# Altium project TMDX654GPEVM.PrjPcb (part 3 of 24)

## Sheet 15-DDR4 DEVICES.SchDoc
size 513 x 386 mm
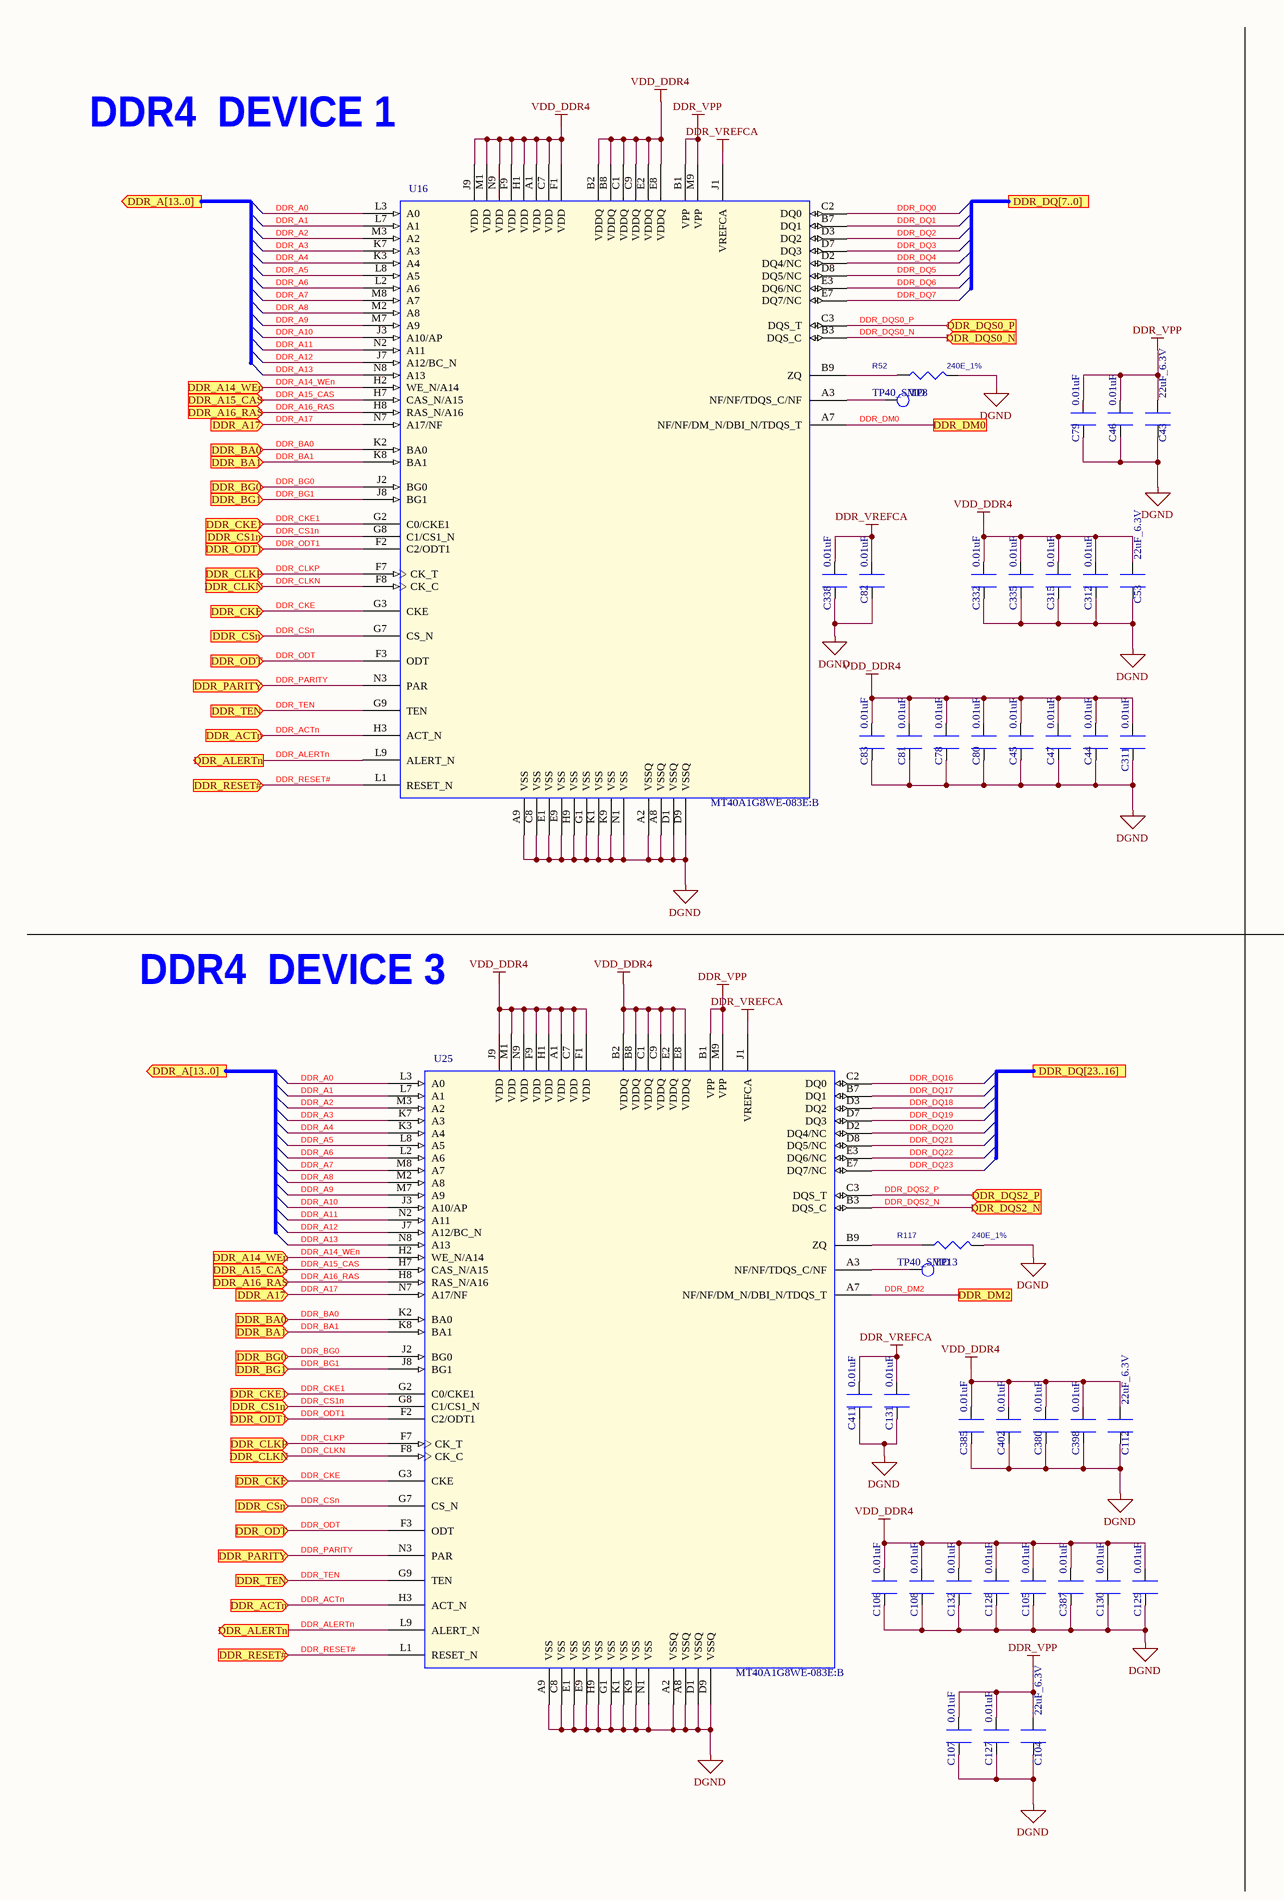
[diagram p20: 15-DDR4 DEVICES.SchDoc, left]
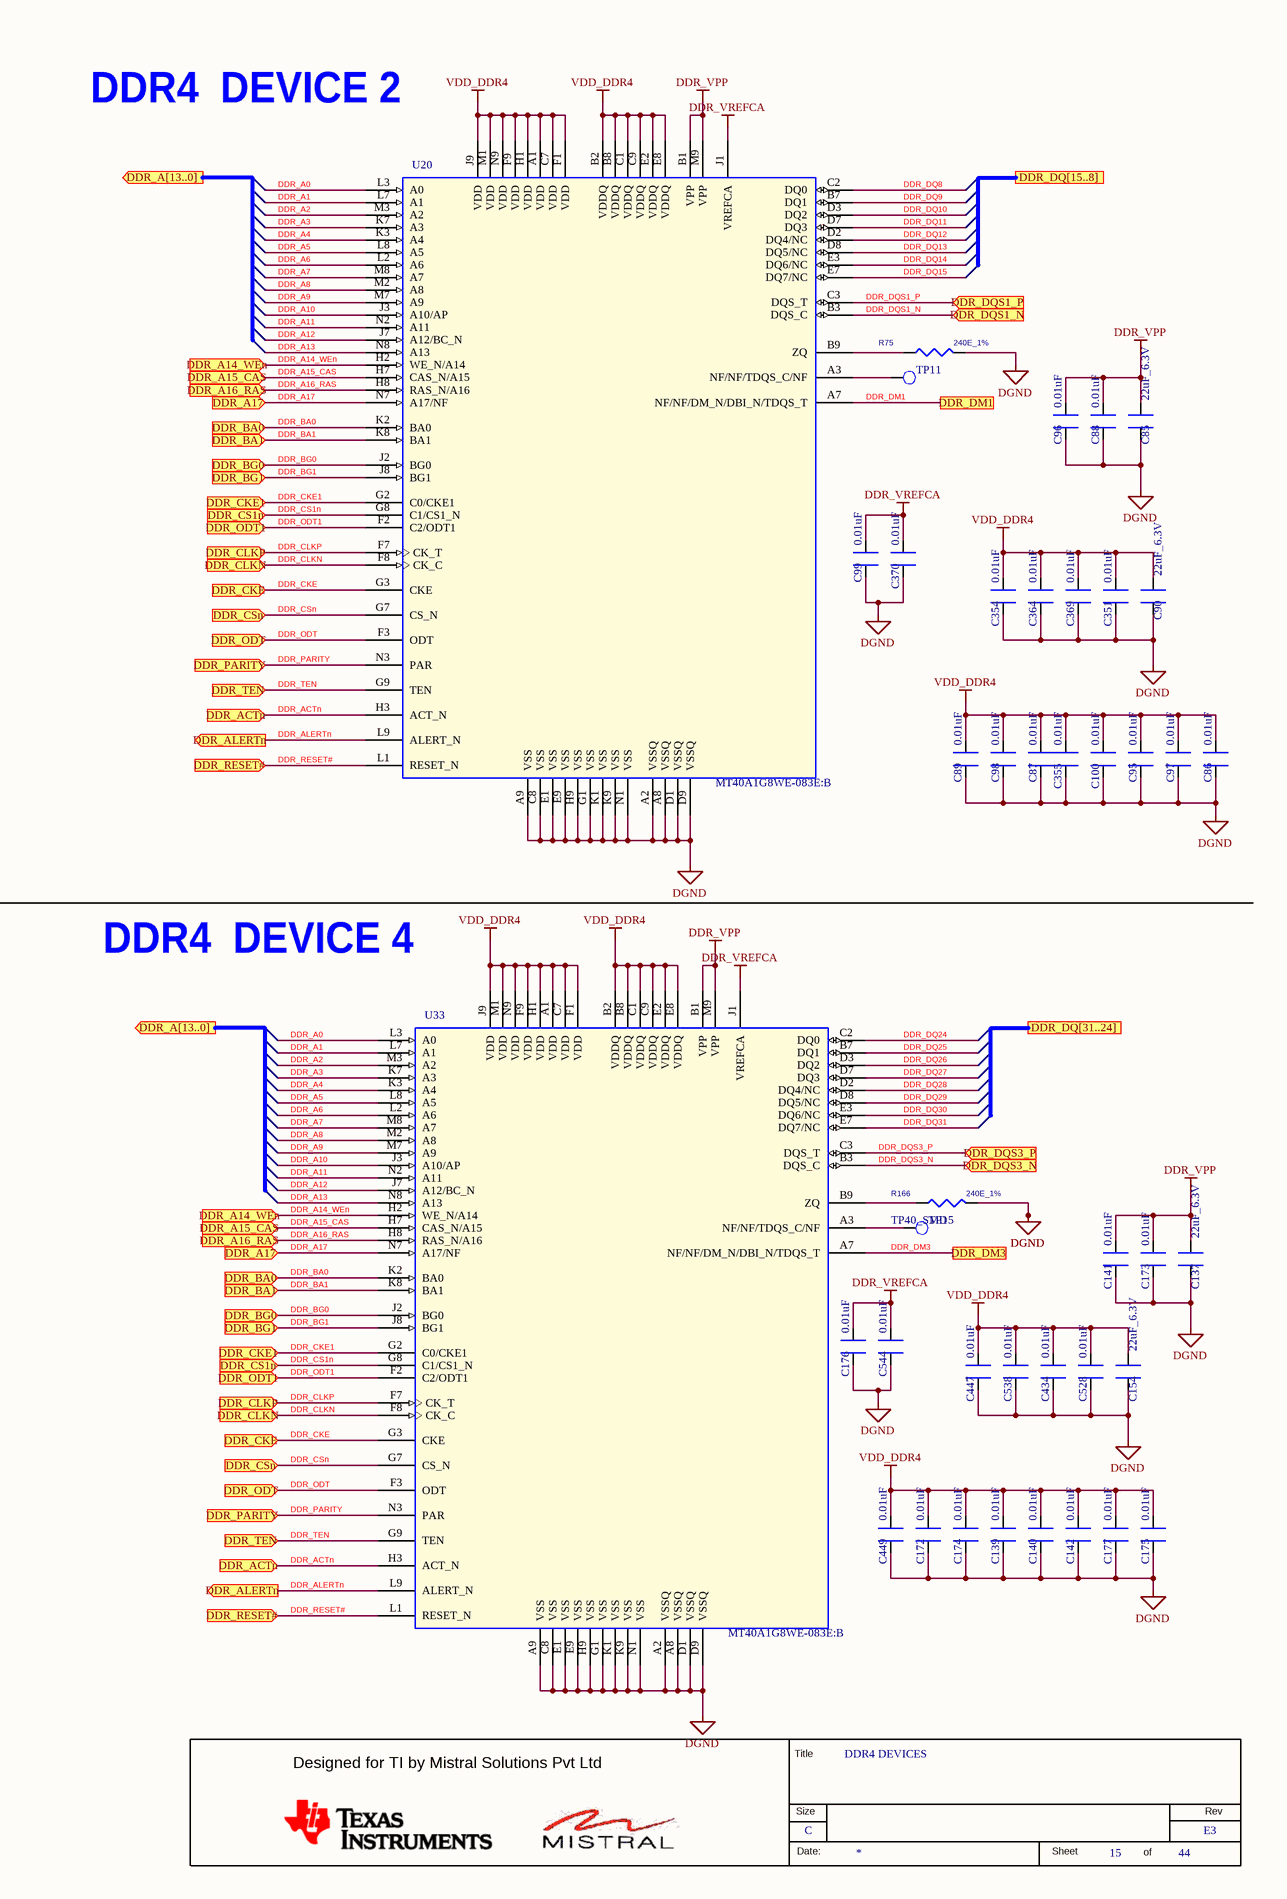
[diagram p21: 15-DDR4 DEVICES.SchDoc, right]

### Parts
(Parts that share a designator on the sheet are numbered #1, #2 ... from top to bottom, then left to right.)
*#15  RevCode: E3  Title: DDR4 DEVICES  Page Size: C  Page Number: 15  Page Count: 44  (hidden comment: MISTRAL_TITLEBLK_CSIZE)  (graphical)
C43  22uF_6.3V  [CAP0603]
C44  0.01uF  [CAP0201_0-5]
C45  0.01uF  [CAP0201_0-5]
C46  0.01uF  [CAP0201_0-5]
C47  0.01uF  [CAP0201_0-5]
C53  22uF_6.3V  [CAP0603]
C78  0.01uF  [CAP0201_0-5]
C79  0.01uF  [CAP0201_0-5]
C80  0.01uF  [CAP0201_0-5]
C81  0.01uF  [CAP0201_0-5]
C82  0.01uF  [CAP0201_0-5]
C83  0.01uF  [CAP0201_0-5]
C85  22uF_6.3V  [CAP0603]
C86  0.01uF  [CAP0201_0-5]
C87  0.01uF  [CAP0201_0-5]
C88  0.01uF  [CAP0201_0-5]
C89  0.01uF  [CAP0201_0-5]
C90  22uF_6.3V  [CAP0603]
C95  0.01uF  [CAP0201_0-5]
C96  0.01uF  [CAP0201_0-5]
C97  0.01uF  [CAP0201_0-5]
C98  0.01uF  [CAP0201_0-5]
C99  0.01uF  [CAP0201_0-5]
C100  0.01uF  [CAP0201_0-5]
C104  22uF_6.3V  [CAP0603]
C105  0.01uF  [CAP0201_0-5]
C106  0.01uF  [CAP0201_0-5]
C107  0.01uF  [CAP0201_0-5]
C108  0.01uF  [CAP0201_0-5]
C112  22uF_6.3V  [CAP0603]
C127  0.01uF  [CAP0201_0-5]
C128  0.01uF  [CAP0201_0-5]
C129  0.01uF  [CAP0201_0-5]
C130  0.01uF  [CAP0201_0-5]
C131  0.01uF  [CAP0201_0-5]
C132  0.01uF  [CAP0201_0-5]
C137  22uF_6.3V  [CAP0603]
C139  0.01uF  [CAP0201_0-5]
C140  0.01uF  [CAP0201_0-5]
C141  0.01uF  [CAP0201_0-5]
C142  0.01uF  [CAP0201_0-5]
C154  22uF_6.3V  [CAP0603]
C172  0.01uF  [CAP0201_0-5]
C173  0.01uF  [CAP0201_0-5]
C174  0.01uF  [CAP0201_0-5]
C175  0.01uF  [CAP0201_0-5]
C176  0.01uF  [CAP0201_0-5]
C177  0.01uF  [CAP0201_0-5]
C311  0.01uF  [CAP0201_0-5]
C312  0.01uF  [CAP0201_0-5]
C315  0.01uF  [CAP0201_0-5]
C332  0.01uF  [CAP0201_0-5]
C335  0.01uF  [CAP0201_0-5]
C338  0.01uF  [CAP0201_0-5]
C351  0.01uF  [CAP0201_0-5]
C354  0.01uF  [CAP0201_0-5]
C355  0.01uF  [CAP0201_0-5]
C364  0.01uF  [CAP0201_0-5]
C369  0.01uF  [CAP0201_0-5]
C370  0.01uF  [CAP0201_0-5]
C380  0.01uF  [CAP0201_0-5]
C385  0.01uF  [CAP0201_0-5]
C387  0.01uF  [CAP0201_0-5]
C398  0.01uF  [CAP0201_0-5]
C402  0.01uF  [CAP0201_0-5]
C411  0.01uF  [CAP0201_0-5]
C434  0.01uF  [CAP0201_0-5]
C447  0.01uF  [CAP0201_0-5]
C449  0.01uF  [CAP0201_0-5]
C528  0.01uF  [CAP0201_0-5]
C538  0.01uF  [CAP0201_0-5]
C544  0.01uF  [CAP0201_0-5]
R52  240E_1%  [RES0402]
R75  240E_1%  [RES0402]
R117  240E_1%  [RES0402]
R166  240E_1%  [RES0402]
TP8  TP40_SMD  [TP40_SMD]
TP11  TP40_SMD  [TP40_SMD]  (value not drawn)
TP13  TP40_SMD  [TP40_SMD]
TP15  TP40_SMD  [TP40_SMD]
U16  MT40A1G8WE-083E:B  [FBGA78_31-49_320X480_1-2]
U20  MT40A1G8WE-083E:B  [FBGA78_31-49_320X480_1-2]
U25  MT40A1G8WE-083E:B  [FBGA78_31-49_320X480_1-2]
U33  MT40A1G8WE-083E:B  [FBGA78_31-49_320X480_1-2]

### Ports
DDR_A14_WEn (in), DDR_A15_CAS (in), DDR_A16_RAS (in), DDR_A17 (in), DDR_A[13..0] (out), DDR_ACTn (in), DDR_ALERTn (out), DDR_BA0 (in), DDR_BA1 (in), DDR_BG0 (in), DDR_BG1 (in), DDR_CKE1 (in), DDR_CKE (in), DDR_CLKN (in), DDR_CLKP (in), DDR_CS1n (in), DDR_CSn (in), DDR_DM0, DDR_DM1, DDR_DM2, DDR_DM3, DDR_DQ[7..0], DDR_DQ[15..8], DDR_DQ[23..16], DDR_DQ[31..24], DDR_DQS0_N (in), DDR_DQS0_P (in), DDR_DQS1_N (in), DDR_DQS1_P (in), DDR_DQS2_N (in), DDR_DQS2_P (in), DDR_DQS3_N (in), DDR_DQS3_P (in), DDR_ODT1 (in), DDR_ODT (in), DDR_PARITY (in), DDR_RESET# (in), DDR_TEN (in)

### Nets
DDR_VPP: C43.1 C46.1 C79.1 C85.1 C88.1 C96.1 C104.1 C107.1 C127.1 C137.1 C141.1 C173.1 U16.B1(VPP) U16.M9(VPP) U20.B1(VPP) U20.M9(VPP) U25.B1(VPP) U25.M9(VPP) U33.B1(VPP) U33.M9(VPP)
DDR_VREFCA: C82.1 C99.1 C131.1 C176.1 C338.1 C370.1 C411.1 C544.1 U16.J1(VREFCA) U20.J1(VREFCA) U25.J1(VREFCA) U33.J1(VREFCA)
DGND: C43.2 C44.2 C45.2 C46.2 C47.2 C53.2 C78.2 C79.2 C80.2 C81.2 C82.2 C83.2 C85.2 C86.2 C87.2 C88.2 C89.2 C90.2 C95.2 C96.2 C97.2 C98.2 C99.2 C100.2 C104.2 C105.2 C106.2 C107.2 C108.2 C112.2 C127.2 C128.2 C129.2 C130.2 C131.2 C132.2 C137.2 C139.2 C140.2 C141.2 C142.2 C154.2 C172.2 C173.2 C174.2 C175.2 C176.2 C177.2 C311.2 C312.2 C315.2 C332.2 C335.2 C338.2 C351.2 C354.2 C355.2 C364.2 C369.2 C370.2 C380.2 C385.2 C387.2 C398.2 C402.2 C411.2 C434.2 C447.2 C449.2 C528.2 C538.2 C544.2 R52.2 R75.2 R117.2 R166.2 U16.A2(VSSQ) U16.A8(VSSQ) U16.A9(VSS) U16.C8(VSS) U16.D1(VSSQ) U16.D9(VSSQ) U16.E1(VSS) U16.E9(VSS) U16.G1(VSS) U16.H9(VSS) U16.K1(VSS) U16.K9(VSS) U16.N1(VSS) U20.A2(VSSQ) U20.A8(VSSQ) U20.A9(VSS) U20.C8(VSS) U20.D1(VSSQ) U20.D9(VSSQ) U20.E1(VSS) U20.E9(VSS) U20.G1(VSS) U20.H9(VSS) U20.K1(VSS) U20.K9(VSS) U20.N1(VSS) U25.A2(VSSQ) U25.A8(VSSQ) U25.A9(VSS) U25.C8(VSS) U25.D1(VSSQ) U25.D9(VSSQ) U25.E1(VSS) U25.E9(VSS) U25.G1(VSS) U25.H9(VSS) U25.K1(VSS) U25.K9(VSS) U25.N1(VSS) U33.A2(VSSQ) U33.A8(VSSQ) U33.A9(VSS) U33.C8(VSS) U33.D1(VSSQ) U33.D9(VSSQ) U33.E1(VSS) U33.E9(VSS) U33.G1(VSS) U33.H9(VSS) U33.K1(VSS) U33.K9(VSS) U33.N1(VSS)
VDD_DDR4: C44.1 C45.1 C47.1 C53.1 C78.1 C80.1 C81.1 C83.1 C86.1 C87.1 C89.1 C90.1 C95.1 C97.1 C98.1 C100.1 C105.1 C106.1 C108.1 C112.1 C128.1 C129.1 C130.1 C132.1 C139.1 C140.1 C142.1 C154.1 C172.1 C174.1 C175.1 C177.1 C311.1 C312.1 C315.1 C332.1 C335.1 C351.1 C354.1 C355.1 C364.1 C369.1 C380.1 C385.1 C387.1 C398.1 C402.1 C434.1 C447.1 C449.1 C528.1 C538.1 U16.A1(VDD) U16.B2(VDDQ) U16.B8(VDDQ) U16.C1(VDDQ) U16.C7(VDD) U16.C9(VDDQ) U16.E2(VDDQ) U16.E8(VDDQ) U16.F1(VDD) U16.F9(VDD) U16.H1(VDD) U16.J9(VDD) U16.M1(VDD) U16.N9(VDD) U20.A1(VDD) U20.B2(VDDQ) U20.B8(VDDQ) U20.C1(VDDQ) U20.C7(VDD) U20.C9(VDDQ) U20.E2(VDDQ) U20.E8(VDDQ) U20.F1(VDD) U20.F9(VDD) U20.H1(VDD) U20.J9(VDD) U20.M1(VDD) U20.N9(VDD) U25.A1(VDD) U25.B2(VDDQ) U25.B8(VDDQ) U25.C1(VDDQ) U25.C7(VDD) U25.C9(VDDQ) U25.E2(VDDQ) U25.E8(VDDQ) U25.F1(VDD) U25.F9(VDD) U25.H1(VDD) U25.J9(VDD) U25.M1(VDD) U25.N9(VDD) U33.A1(VDD) U33.B2(VDDQ) U33.B8(VDDQ) U33.C1(VDDQ) U33.C7(VDD) U33.C9(VDDQ) U33.E2(VDDQ) U33.E8(VDDQ) U33.F1(VDD) U33.F9(VDD) U33.H1(VDD) U33.J9(VDD) U33.M1(VDD) U33.N9(VDD)
DDR_A0: U16.L3(A0) U20.L3(A0) U25.L3(A0) U33.L3(A0)
DDR_A1: U16.L7(A1) U20.L7(A1) U25.L7(A1) U33.L7(A1)
DDR_A2: U16.M3(A2) U20.M3(A2) U25.M3(A2) U33.M3(A2)
DDR_A3: U16.K7(A3) U20.K7(A3) U25.K7(A3) U33.K7(A3)
DDR_A4: U16.K3(A4) U20.K3(A4) U25.K3(A4) U33.K3(A4)
DDR_A5: U16.L8(A5) U20.L8(A5) U25.L8(A5) U33.L8(A5)
DDR_A6: U16.L2(A6) U20.L2(A6) U25.L2(A6) U33.L2(A6)
DDR_A7: U16.M8(A7) U20.M8(A7) U25.M8(A7) U33.M8(A7)
DDR_A8: U16.M2(A8) U20.M2(A8) U25.M2(A8) U33.M2(A8)
DDR_A9: U16.M7(A9) U20.M7(A9) U25.M7(A9) U33.M7(A9)
DDR_A10: U16.J3(A10/AP) U20.J3(A10/AP) U25.J3(A10/AP) U33.J3(A10/AP)
DDR_A11: U16.N2(A11) U20.N2(A11) U25.N2(A11) U33.N2(A11)
DDR_A12: U16.J7(A12/BC_N) U20.J7(A12/BC_N) U25.J7(A12/BC_N) U33.J7(A12/BC_N)
DDR_A13: U16.N8(A13) U20.N8(A13) U25.N8(A13) U33.N8(A13)
DDR_A14_WEn: U16.H2(WE_N/A14) U20.H2(WE_N/A14) U25.H2(WE_N/A14) U33.H2(WE_N/A14) ; port DDR_A14_WEn
DDR_A15_CAS: U16.H7(CAS_N/A15) U20.H7(CAS_N/A15) U25.H7(CAS_N/A15) U33.H7(CAS_N/A15) ; port DDR_A15_CAS
DDR_A16_RAS: U16.H8(RAS_N/A16) U20.H8(RAS_N/A16) U25.H8(RAS_N/A16) U33.H8(RAS_N/A16) ; port DDR_A16_RAS
DDR_A17: U16.N7(A17/NF) U20.N7(A17/NF) U25.N7(A17/NF) U33.N7(A17/NF) ; port DDR_A17
DDR_ACTn: U16.H3(ACT_N) U20.H3(ACT_N) U25.H3(ACT_N) U33.H3(ACT_N) ; port DDR_ACTn
DDR_ALERTn: U16.L9(ALERT_N) U20.L9(ALERT_N) U25.L9(ALERT_N) U33.L9(ALERT_N) ; port DDR_ALERTn
DDR_BA0: U16.K2(BA0) U20.K2(BA0) U25.K2(BA0) U33.K2(BA0) ; port DDR_BA0
DDR_BA1: U16.K8(BA1) U20.K8(BA1) U25.K8(BA1) U33.K8(BA1) ; port DDR_BA1
DDR_BG0: U16.J2(BG0) U20.J2(BG0) U25.J2(BG0) U33.J2(BG0) ; port DDR_BG0
DDR_BG1: U16.J8(BG1) U20.J8(BG1) U25.J8(BG1) U33.J8(BG1) ; port DDR_BG1
DDR_CKE: U16.G3(CKE) U20.G3(CKE) U25.G3(CKE) U33.G3(CKE) ; port DDR_CKE
DDR_CKE1: U16.G2(C0/CKE1) U20.G2(C0/CKE1) U25.G2(C0/CKE1) U33.G2(C0/CKE1) ; port DDR_CKE1
DDR_CLKN: U16.F8(CK_C) U20.F8(CK_C) U25.F8(CK_C) U33.F8(CK_C) ; port DDR_CLKN
DDR_CLKP: U16.F7(CK_T) U20.F7(CK_T) U25.F7(CK_T) U33.F7(CK_T) ; port DDR_CLKP
DDR_CS1n: U16.G8(C1/CS1_N) U20.G8(C1/CS1_N) U25.G8(C1/CS1_N) U33.G8(C1/CS1_N) ; port DDR_CS1n
DDR_CSn: U16.G7(CS_N) U20.G7(CS_N) U25.G7(CS_N) U33.G7(CS_N) ; port DDR_CSn
DDR_DM0: U16.A7(NF/NF/DM_N/DBI_N/TDQS_T) ; port DDR_DM0
DDR_DM1: U20.A7(NF/NF/DM_N/DBI_N/TDQS_T) ; port DDR_DM1
DDR_DM2: U25.A7(NF/NF/DM_N/DBI_N/TDQS_T) ; port DDR_DM2
DDR_DM3: U33.A7(NF/NF/DM_N/DBI_N/TDQS_T) ; port DDR_DM3
DDR_DQ0: U16.C2(DQ0)
DDR_DQ1: U16.B7(DQ1)
DDR_DQ2: U16.D3(DQ2)
DDR_DQ3: U16.D7(DQ3)
DDR_DQ4: U16.D2(DQ4/NC)
DDR_DQ5: U16.D8(DQ5/NC)
DDR_DQ6: U16.E3(DQ6/NC)
DDR_DQ7: U16.E7(DQ7/NC)
DDR_DQ8: U20.C2(DQ0)
DDR_DQ9: U20.B7(DQ1)
DDR_DQ10: U20.D3(DQ2)
DDR_DQ11: U20.D7(DQ3)
DDR_DQ12: U20.D2(DQ4/NC)
DDR_DQ13: U20.D8(DQ5/NC)
DDR_DQ14: U20.E3(DQ6/NC)
DDR_DQ15: U20.E7(DQ7/NC)
DDR_DQ16: U25.C2(DQ0)
DDR_DQ17: U25.B7(DQ1)
DDR_DQ18: U25.D3(DQ2)
DDR_DQ19: U25.D7(DQ3)
DDR_DQ20: U25.D2(DQ4/NC)
DDR_DQ21: U25.D8(DQ5/NC)
DDR_DQ22: U25.E3(DQ6/NC)
DDR_DQ23: U25.E7(DQ7/NC)
DDR_DQ24: U33.C2(DQ0)
DDR_DQ25: U33.B7(DQ1)
DDR_DQ26: U33.D3(DQ2)
DDR_DQ27: U33.D7(DQ3)
DDR_DQ28: U33.D2(DQ4/NC)
DDR_DQ29: U33.D8(DQ5/NC)
DDR_DQ30: U33.E3(DQ6/NC)
DDR_DQ31: U33.E7(DQ7/NC)
DDR_DQS0_N: U16.B3(DQS_C) ; port DDR_DQS0_N
DDR_DQS0_P: U16.C3(DQS_T) ; port DDR_DQS0_P
DDR_DQS1_N: U20.B3(DQS_C) ; port DDR_DQS1_N
DDR_DQS1_P: U20.C3(DQS_T) ; port DDR_DQS1_P
DDR_DQS2_N: U25.B3(DQS_C) ; port DDR_DQS2_N
DDR_DQS2_P: U25.C3(DQS_T) ; port DDR_DQS2_P
DDR_DQS3_N: U33.B3(DQS_C) ; port DDR_DQS3_N
DDR_DQS3_P: U33.C3(DQS_T) ; port DDR_DQS3_P
DDR_ODT: U16.F3(ODT) U20.F3(ODT) U25.F3(ODT) U33.F3(ODT) ; port DDR_ODT
DDR_ODT1: U16.F2(C2/ODT1) U20.F2(C2/ODT1) U25.F2(C2/ODT1) U33.F2(C2/ODT1) ; port DDR_ODT1
DDR_PARITY: U16.N3(PAR) U20.N3(PAR) U25.N3(PAR) U33.N3(PAR) ; port DDR_PARITY
DDR_RESET#: U16.L1(RESET_N) U20.L1(RESET_N) U25.L1(RESET_N) U33.L1(RESET_N) ; port DDR_RESET#
DDR_TEN: U16.G9(TEN) U20.G9(TEN) U25.G9(TEN) U33.G9(TEN) ; port DDR_TEN
NetR52_1: R52.1 U16.B9(ZQ)
NetR75_1: R75.1 U20.B9(ZQ)
NetR117_1: R117.1 U25.B9(ZQ)
NetR166_1: R166.1 U33.B9(ZQ)
NetTP8_1: TP8.1(TP) U16.A3(NF/NF/TDQS_C/NF)
NetTP11_1: TP11.1(TP) U20.A3(NF/NF/TDQS_C/NF)
NetTP13_1: TP13.1(TP) U25.A3(NF/NF/TDQS_C/NF)
NetTP15_1: TP15.1(TP) U33.A3(NF/NF/TDQS_C/NF)

### Notes on the sheet
- DDR4  DEVICE 1
- DDR4  DEVICE 2
- DDR4  DEVICE 3
- DDR4  DEVICE 4
- (in symbol MISTRAL_TITLEBLK_CSIZE) Title; Designed for TI by Mistral Solutions Pvt Ltd; Size; Rev; Date:; Sheet; of

### Library data of the parts
*#15 = MISTRAL_TITLEBLK_CSIZE: Issue: 1.0; Page Create Date: March  8, 1995; Page Modify Date: *
C43 C90 C112 C154 = CAP_Dup3: CAP CERAMIC 22uF 6.3V 20% X5R 0603; Alternate_mfr_part_number_A: CC0603MRX5R5BB226; Alternate_mfr_name_A: YAGEO AMERICA; Part_type: CAPACITORS\CERAMIC; Mfr_part_number: GRM188R60J226MEA0; Mfr_name: MURATA; Mistral Part No: 120015090007-R; Custom_Duty: 15%; Customs_HS_Code: 85322990; Wattage: NA; Project: OCTBTS_3000; Distributor_part_number_A: 311-1815-1-ND; Distributor_name_A: DIGIKEY; Library Ref: CAP; Chkd/date: JEBRAN/090915; Crtd /date: JEBRAN/090915; Datasheet: Y:\MIS_DATABASE\DATASHEETS\CAPACITORS\GRM188SERIES.PDF; Temperature: -55°C+85°C; Weight: NA; Height: 1.00MM; Distributor_part_number: 490-7611-2-ND; Distributor_name: DIGIKEY; Package: 0603; Voltage: 6.3V; Tolerance: 20%; PCB Footprint: CAP0603
C44-C47 C78-C81 C83 C87 C89 C95 C97 C98 C100 C105 C106 C108 C128 C130 C132 C139 C140 C142 C172 C174 C177 C311 C351 C354 C355 C364 C369 C380 C385 C387 C398 C402 C434 C447 C449 C528 C538 = CAP_Dup3: CAP CERAMIC 0.01uF 25V 10% X5R 0201; Mistral Part No: 120018010007-R; Mfr_name: MURATA; Mfr_part_number: GRM033R61E103KA12J; Part_type: CAPACITORS\CERAMIC; Wattage: NA; Project: TI_MAXIE_CPB; Customs_HS_Code: 85322990; Custom_Duty: 15%; Library Ref: CAP; MECHANICAL 3D STEP FILE: CAP0201_0-5; Temperature: -55°C+85°C; Weight: 0.33mg; PCB Footprint: CAP0201_0-5; Tolerance: 10%; Voltage: 25V; Package: 0201; Distributor_name: DIGIKEY; Distributor_part_number: GRM033R61E103KA12J-ND; Height: 0.33MM; Datasheet: Y:\MIS_DATABASE\DATASHEETS\CAPACITORS\GRM033R61E103KA12.PDF; Crtd /date: MANIRAJA/230118; Chkd/date: MANIRAJA/230118
C53 C104 C137 = CAP_Dup3: CAP CERAMIC 22uF 6.3V 20% X5R 0603; Alternate_mfr_part_number_A: CC0603MRX5R5BB226; Alternate_mfr_name_A: YAGEO AMERICA; Mistral Part No: 120015090007-R; Mfr_name: MURATA; Mfr_part_number: GRM188R60J226MEA0; Part_type: CAPACITORS\CERAMIC; Project: OCTBTS_3000; Wattage: NA; Customs_HS_Code: 85322990; Custom_Duty: 15%; Distributor_part_number_A: 311-1815-1-ND; Distributor_name_A: DIGIKEY; Library Ref: CAP; Tolerance: 20%; Voltage: 6.3V; Package: 0603; Distributor_name: DIGIKEY; Distributor_part_number: 490-7611-2-ND; Height: 1.00MM; Weight: NA; Temperature: -55°C+85°C; Datasheet: Y:\MIS_DATABASE\DATASHEETS\CAPACITORS\GRM188SERIES.PDF; Crtd /date: JEBRAN/090915; Chkd/date: JEBRAN/090915; PCB Footprint: CAP0603
C82 C86 C88 C96 C99 C107 C127 C129 C131 C141 C173 C175 C176 C312 C315 C332 C335 C338 C370 C411 C544 = CAP_Dup3: CAP CERAMIC 0.01uF 25V 10% X5R 0201; Part_type: CAPACITORS\CERAMIC; Mfr_part_number: GRM033R61E103KA12J; Mfr_name: MURATA; Mistral Part No: 120018010007-R; Wattage: NA; Custom_Duty: 15%; Customs_HS_Code: 85322990; Project: TI_MAXIE_CPB; Library Ref: CAP; MECHANICAL 3D STEP FILE: CAP0201_0-5; Temperature: -55°C+85°C; Weight: 0.33mg; PCB Footprint: CAP0201_0-5; Chkd/date: MANIRAJA/230118; Crtd /date: MANIRAJA/230118; Datasheet: Y:\MIS_DATABASE\DATASHEETS\CAPACITORS\GRM033R61E103KA12.PDF; Height: 0.33MM; Distributor_part_number: GRM033R61E103KA12J-ND; Distributor_name: DIGIKEY; Package: 0201; Voltage: 25V; Tolerance: 10%
C85 = CAP_Dup3: CAP CERAMIC 22uF 6.3V 20% X5R 0603; Part_type: CAPACITORS\CERAMIC; Mfr_part_number: GRM188R60J226MEA0; Mfr_name: MURATA; Mistral Part No: 120015090007-R; Alternate_mfr_name_A: YAGEO AMERICA; Alternate_mfr_part_number_A: CC0603MRX5R5BB226; Custom_Duty: 15%; Customs_HS_Code: 85322990; Wattage: NA; Project: OCTBTS_3000; Chkd/date: JEBRAN/090915; Crtd /date: JEBRAN/090915; Datasheet: Y:\MIS_DATABASE\DATASHEETS\CAPACITORS\GRM188SERIES.PDF; Temperature: -55°C+85°C; Weight: NA; Height: 1.00MM; Distributor_part_number: 490-7611-2-ND; Distributor_name: DIGIKEY; Package: 0603; Voltage: 6.3V; Tolerance: 20%; Library Ref: CAP; Distributor_name_A: DIGIKEY; Distributor_part_number_A: 311-1815-1-ND; PCB Footprint: CAP0603
R52 R75 = RESISTOR_Dup1: RES 240E 1/10W 1% 0402; Part_type: RESISTORS\FIXED; Mfr_part_number: ERJ-2RKF2400X; Mfr_name: PANASONIC-ECG; Mistral Part No: 110011060017-R; Custom_Duty: 15%; Customs_HS_Code: 85332119; Voltage: NA; Project: AM4515_EVM_LCD; Library Ref: RESISTOR; Chkd/date: MAZHAR/150611; Crtd /date: BAVISH/020611; Datasheet: Y:\MIS_DATABASE\DATASHEETS\RESISTORS\ERJ-2R.PDF; Temperature: -55°C+125°C; Weight: 0.8/1000g; Height: 0.40MM; Distributor_part_number: P240LCT-ND; Distributor_name: DIGIKEY; Package: 0402; Wattage: 1/10W; Tolerance: 1%; PCB Footprint: RES0402
R117 R166 = RESISTOR_Dup1: RES 240E 1/10W 1% 0402; Mistral Part No: 110011060017-R; Mfr_name: PANASONIC-ECG; Mfr_part_number: ERJ-2RKF2400X; Part_type: RESISTORS\FIXED; Project: AM4515_EVM_LCD; Voltage: NA; Customs_HS_Code: 85332119; Custom_Duty: 15%; Library Ref: RESISTOR; Tolerance: 1%; Wattage: 1/10W; Package: 0402; Distributor_name: DIGIKEY; Distributor_part_number: P240LCT-ND; Height: 0.40MM; Weight: 0.8/1000g; Temperature: -55°C+125°C; Datasheet: Y:\MIS_DATABASE\DATASHEETS\RESISTORS\ERJ-2R.PDF; Crtd /date: BAVISH/020611; Chkd/date: MAZHAR/150611; PCB Footprint: RES0402
TP8 TP13 TP15 = TESTPOINT: TESTPOINT CIR 40 SMD; Mistral Part No: 130009030933; Mfr_name: LOCAL; MECHANICAL 3D STEP FILE: NA; Project: RAINIER-3; NI_MARK: DNI; RoHS: NA; Footprint Ref: TP40_SMD; Library Ref: TESTPOINT; Footprint Path: Y:\MIS_DATABASE\Library\ALTIUM_TOOL\PCB_FOOTPRINTS\Altium_Footprint_Lib.PcbLib; Library Path: Y:\MIS_DATABASE\Library\ALTIUM_TOOL\SCHEMATICS_PARTS\MS_DISCRETE_Library.schlib; Datasheet: NA; Temperature: NA; Weight: NA; Wattage: NA; Voltage: NA; Tolerance: NA; Mfr_part_number: TP40_SMD; Part_type: TESTPOINT; Package: SMD; Distributor_name: NA; Distributor_part_number: NA; Height: NA; Crtd /date: MAZHAR/190505; Chkd/date: MAZHAR/190505; PCB Footprint: TP40_SMD
TP11 = TESTPOINT: TESTPOINT CIR 40 SMD; Mfr_name: LOCAL; Mistral Part No: 130009030933; Project: RAINIER-3; Tolerance: NA; NI_MARK: DNI; Chkd/date: MAZHAR/190505; Crtd /date: MAZHAR/190505; Height: NA; Distributor_part_number: NA; Distributor_name: NA; Package: SMD; Part_type: TESTPOINT; Mfr_part_number: TP40_SMD; Voltage: NA; Wattage: NA; Weight: NA; Temperature: NA; Datasheet: NA; MECHANICAL 3D STEP FILE: NA; Library Path: Y:\MIS_DATABASE\Library\ALTIUM_TOOL\SCHEMATICS_PARTS\MS_DISCRETE_Library.schlib; Footprint Path: Y:\MIS_DATABASE\Library\ALTIUM_TOOL\PCB_FOOTPRINTS\Altium_Footprint_Lib.PcbLib; Library Ref: TESTPOINT; Footprint Ref: TP40_SMD; RoHS: NA; PCB Footprint: TP40_SMD
U16 U20 = MT40A1G8WE-083_FBGA78: IC 1G8 DDR4 SDRAM MEMORY FBGA78; Part_type: ICS\DIGITAL\MEMORY; Mfr_name: MICRON; Mistral Part No: 141117080006-R; Custom_Duty: 15%; Customs_HS_Code: 85423100; Wattage: NA; Project: TI_MAXIE_CPB; Library Ref: MT40A1G8WE-083_FBGA78; MECHANICAL 3D STEP FILE: FBGA78_31-49_320X480_1-2; Chkd/date: MANIRAJA/220817; Crtd /date: MANIRAJA/220817; Datasheet: Y:\MIS_DATABASE\DATASHEETS\ICS\MEMORY\MT40AXX.PDF; Temperature: 0°C+95°C; Weight: NA; Height: 1.20MM; Distributor_part_number: 557-1727-1-ND; Distributor_name: DIGIKEY; Package: FBGA78; Voltage: NA; Tolerance: NA; Mfr_part_number: MT40A1G8WE-083E:B; PCB Footprint: FBGA78_31-49_320X480_1-2
U25 U33 = MT40A1G8WE-083_FBGA78: IC 1G8 DDR4 SDRAM MEMORY FBGA78; Mistral Part No: 141117080006-R; Mfr_name: MICRON; Part_type: ICS\DIGITAL\MEMORY; Project: TI_MAXIE_CPB; Tolerance: NA; Customs_HS_Code: 85423100; Custom_Duty: 15%; Library Ref: MT40A1G8WE-083_FBGA78; Mfr_part_number: MT40A1G8WE-083E:B; Voltage: NA; Wattage: NA; Package: FBGA78; Distributor_name: DIGIKEY; Distributor_part_number: 557-1727-1-ND; Height: 1.20MM; Weight: NA; Temperature: 0°C+95°C; Datasheet: Y:\MIS_DATABASE\DATASHEETS\ICS\MEMORY\MT40AXX.PDF; Crtd /date: MANIRAJA/220817; Chkd/date: MANIRAJA/220817; MECHANICAL 3D STEP FILE: FBGA78_31-49_320X480_1-2; PCB Footprint: FBGA78_31-49_320X480_1-2

## Sheet 16-DDR4 ECC AND TERMINATIONS.SchDoc
size 513 x 386 mm
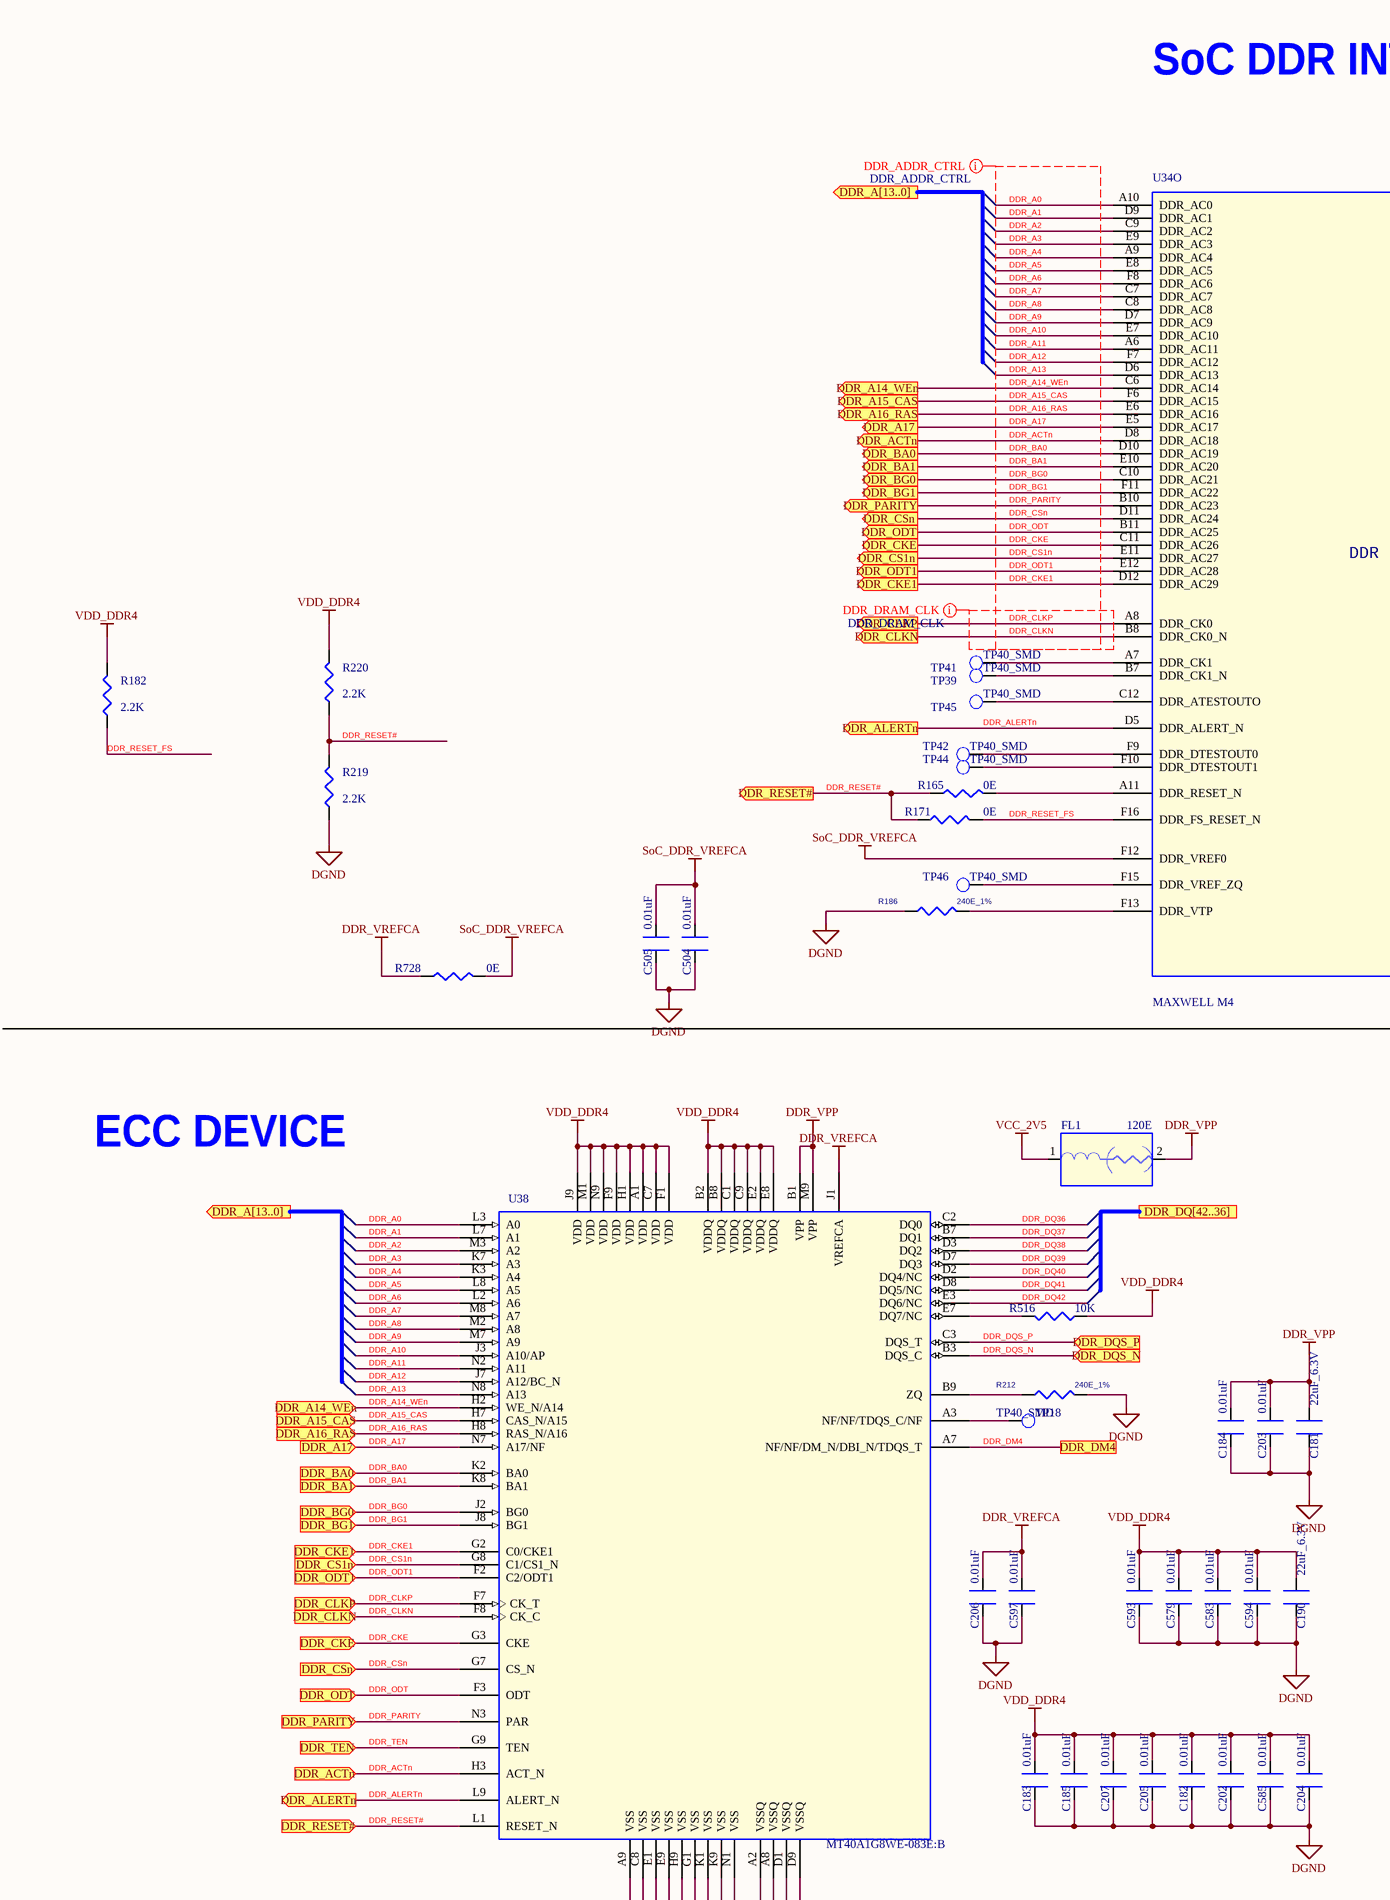
[diagram p22: 16-DDR4 ECC AND TERMINATIONS.SchDoc, top left]
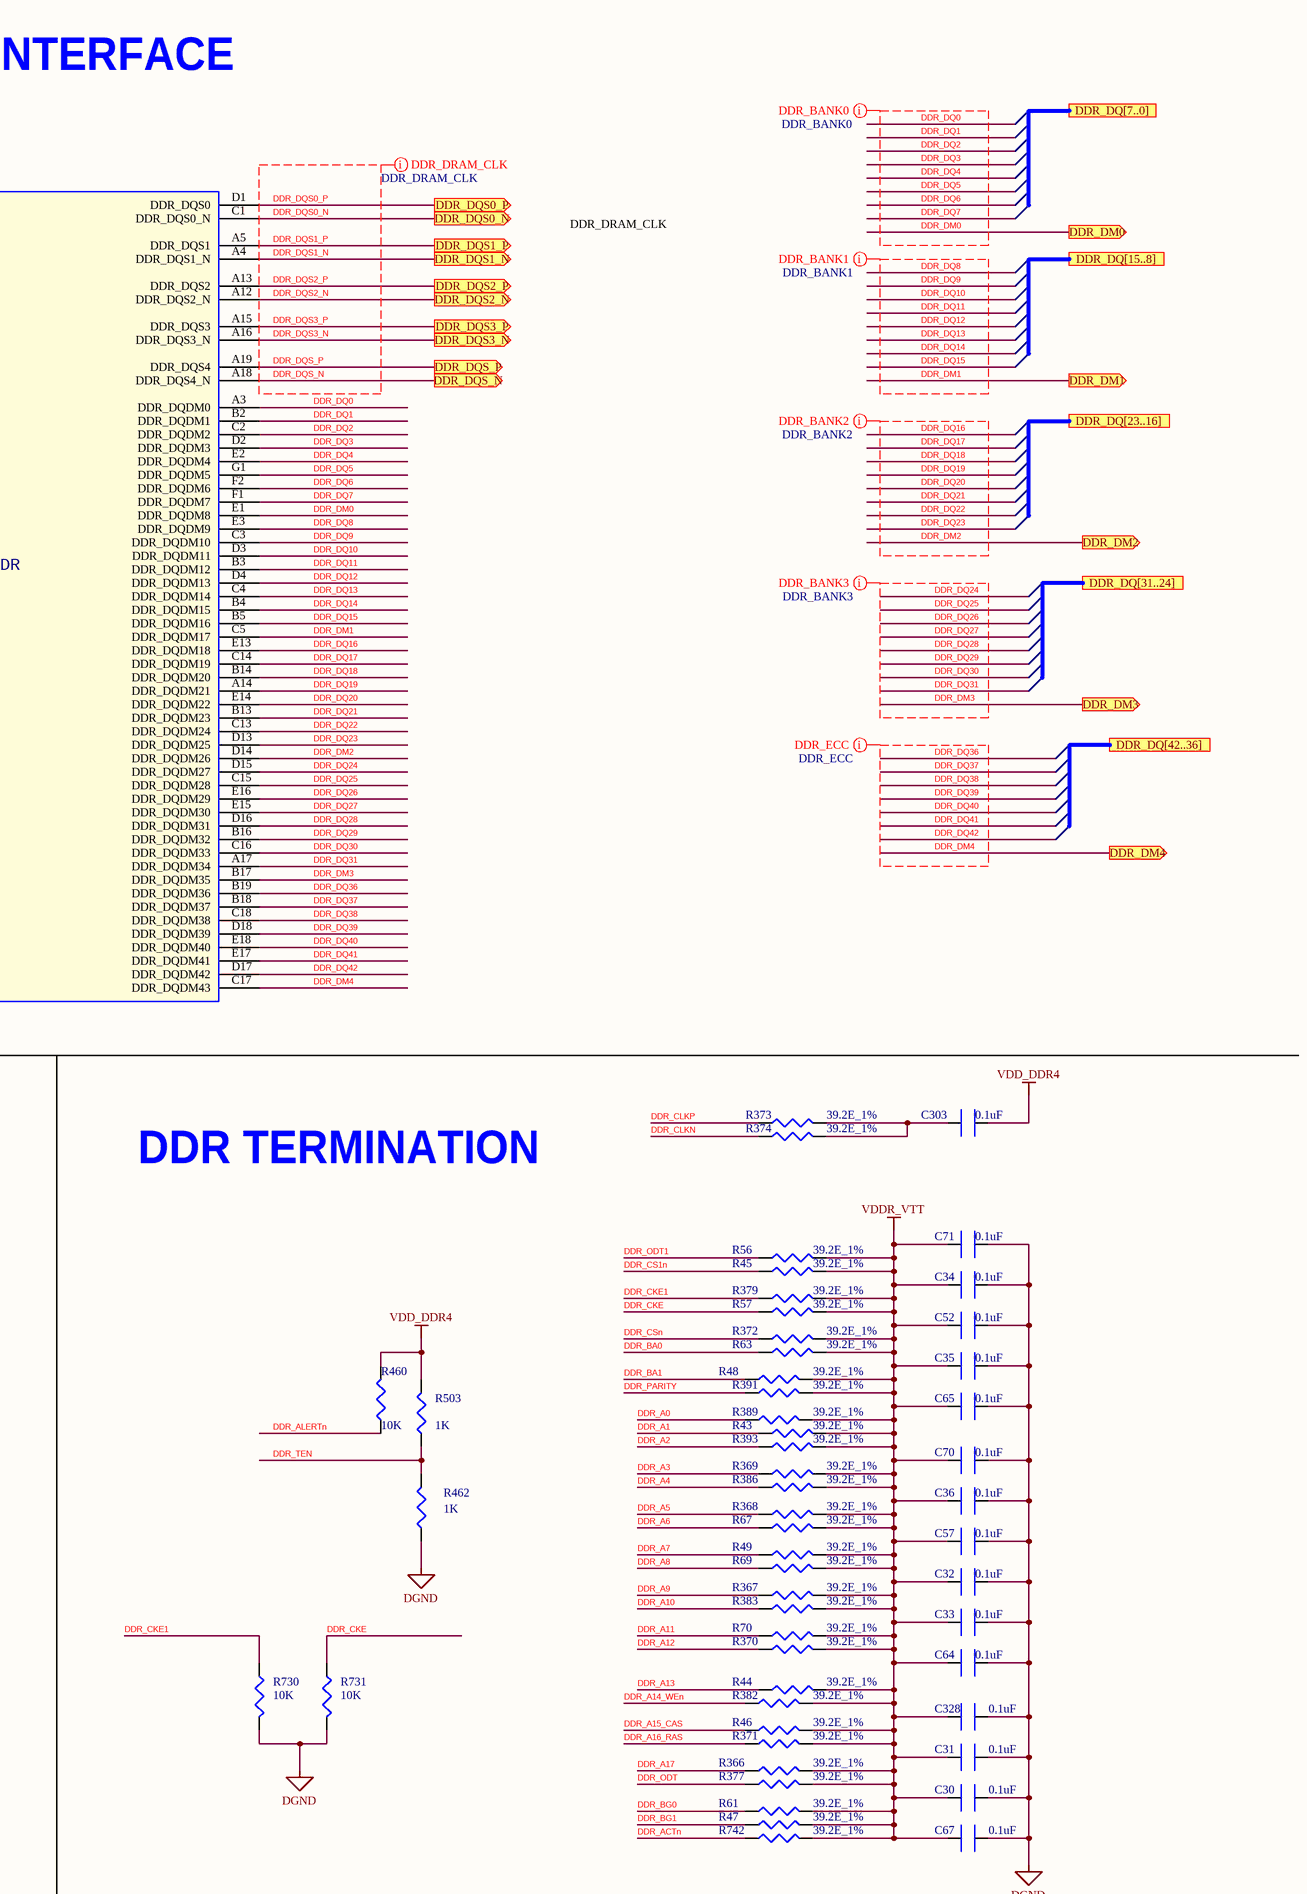
[diagram p23: 16-DDR4 ECC AND TERMINATIONS.SchDoc, top right]
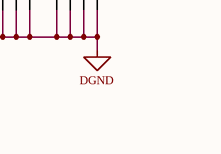
[diagram p24: 16-DDR4 ECC AND TERMINATIONS.SchDoc, bottom left]
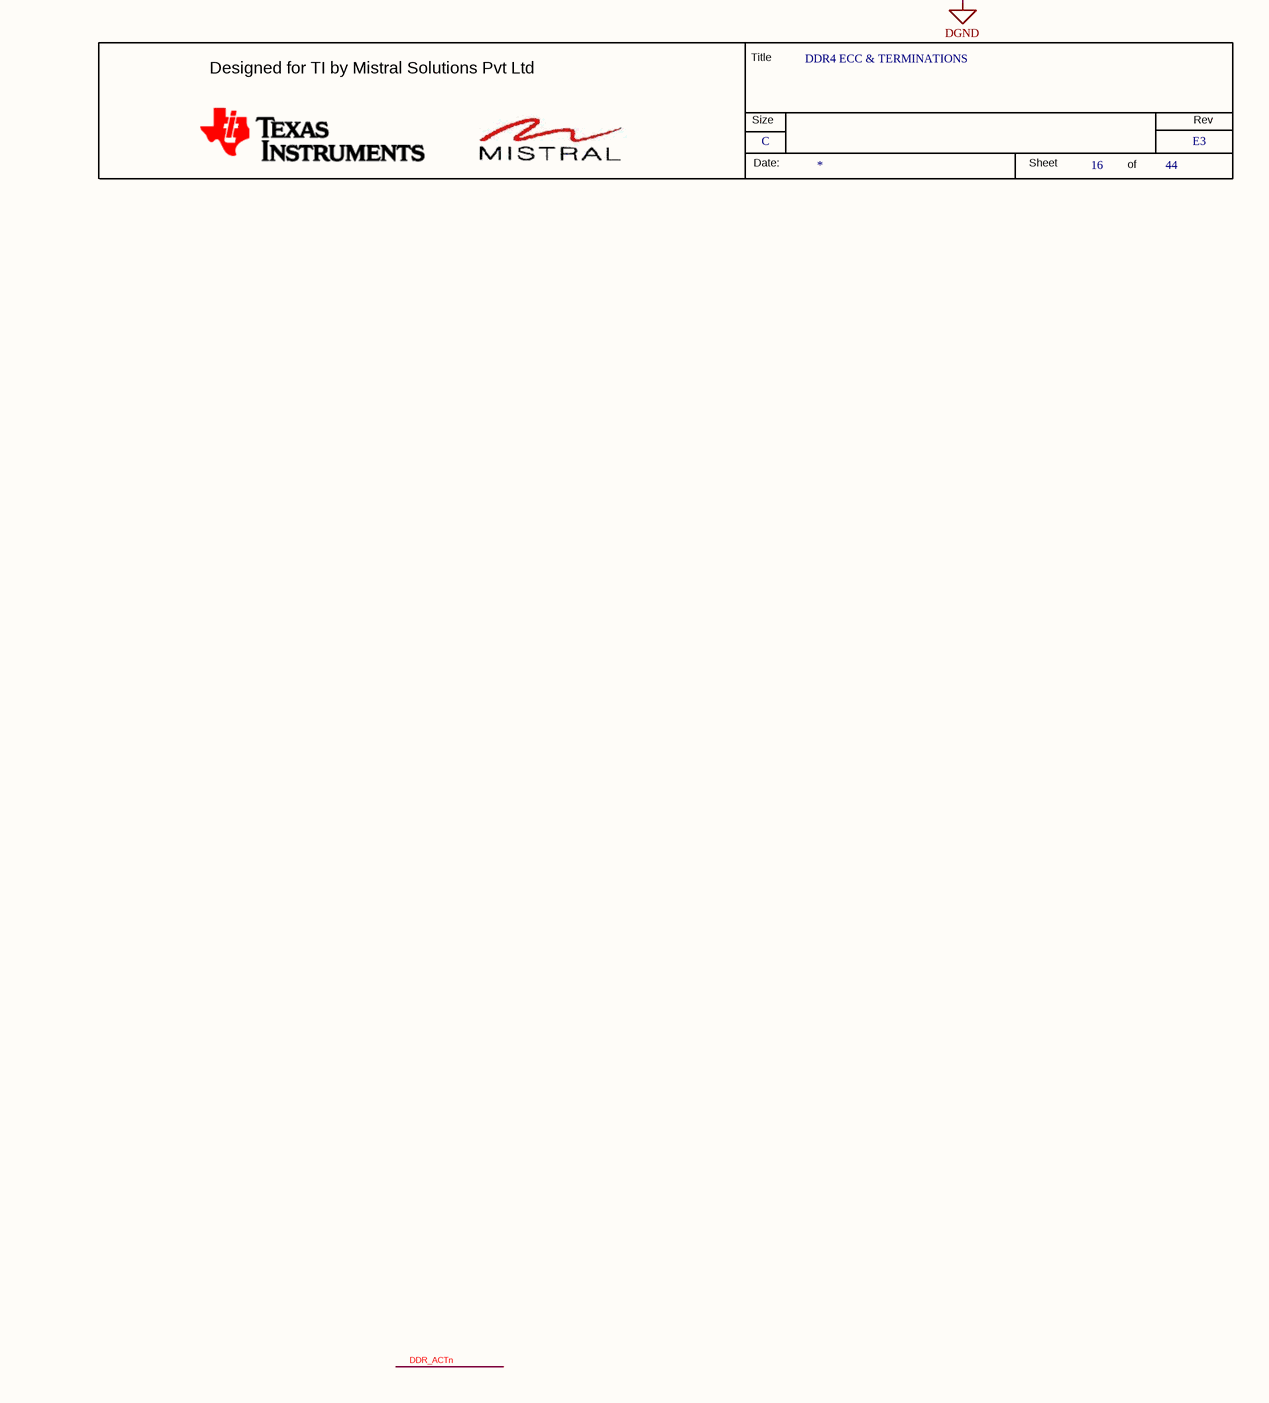
[diagram p25: 16-DDR4 ECC AND TERMINATIONS.SchDoc, bottom right]

### Parts
(Parts that share a designator on the sheet are numbered #1, #2 ... from top to bottom, then left to right.)
*#16  RevCode: E3  Title: DDR4 ECC & TERMINATIONS  Page Size: C  Page Number: 16  Page Count: 44  (hidden comment: MISTRAL_TITLEBLK_CSIZE)  (graphical)
C30  0.1uF  [CAP0201_0-5]
C31  0.1uF  [CAP0201_0-5]
C32  0.1uF  [CAP0201_0-5]
C33  0.1uF  [CAP0201_0-5]
C34  0.1uF  [CAP0201_0-5]
C35  0.1uF  [CAP0201_0-5]
C36  0.1uF  [CAP0201_0-5]
C52  0.1uF  [CAP0201_0-5]
C57  0.1uF  [CAP0201_0-5]
C64  0.1uF  [CAP0201_0-5]
C65  0.1uF  [CAP0201_0-5]
C67  0.1uF  [CAP0201_0-5]
C70  0.1uF  [CAP0201_0-5]
C71  0.1uF  [CAP0201_0-5]
C181  22uF_6.3V  [CAP0603]
C182  0.01uF  [CAP0201_0-5]
C183  0.01uF  [CAP0201_0-5]
C184  0.01uF  [CAP0201_0-5]
C185  0.01uF  [CAP0201_0-5]
C190  22uF_6.3V  [CAP0603]
C202  0.01uF  [CAP0201_0-5]
C203  0.01uF  [CAP0201_0-5]
C204  0.01uF  [CAP0201_0-5]
C205  0.01uF  [CAP0201_0-5]
C206  0.01uF  [CAP0201_0-5]
C207  0.01uF  [CAP0201_0-5]
C303  0.1uF  [CAP0201_0-5]
C328  0.1uF  [CAP0201_0-5]
C504  0.01uF  [CAP0201_0-5]
C505  0.01uF  [CAP0201_0-5]
C579  0.01uF  [CAP0201_0-5]
C583  0.01uF  [CAP0201_0-5]
C585  0.01uF  [CAP0201_0-5]
C593  0.01uF  [CAP0201_0-5]
C594  0.01uF  [CAP0201_0-5]
C597  0.01uF  [CAP0201_0-5]
FL1  120E  [EMIFIL_BLM15A_0402_0-6]
R43  39.2E_1%  [RES0402]
R44  39.2E_1%  [RES0402]
R45  39.2E_1%  [RES0402]
R46  39.2E_1%  [RES0402]
R47  39.2E_1%  [RES0402]
R48  39.2E_1%  [RES0402]
R49  39.2E_1%  [RES0402]
R56  39.2E_1%  [RES0402]
R57  39.2E_1%  [RES0402]
R61  39.2E_1%  [RES0402]
R63  39.2E_1%  [RES0402]
R67  39.2E_1%  [RES0402]
R69  39.2E_1%  [RES0402]
R70  39.2E_1%  [RES0402]
R165  0E  [RES0402_0-5]
R171  0E  [RES0402_0-5]
R182  2.2K  [RES0402_0-5]
R186  240E_1%  [RES0402]
R212  240E_1%  [RES0402]
R219  2.2K  [RES0402_0-5]
R220  2.2K  [RES0402_0-5]
R366  39.2E_1%  [RES0402]
R367  39.2E_1%  [RES0402]
R368  39.2E_1%  [RES0402]
R369  39.2E_1%  [RES0402]
R370  39.2E_1%  [RES0402]
R371  39.2E_1%  [RES0402]
R372  39.2E_1%  [RES0402]
R373  39.2E_1%  [RES0402]
R374  39.2E_1%  [RES0402]
R377  39.2E_1%  [RES0402]
R379  39.2E_1%  [RES0402]
R382  39.2E_1%  [RES0402]
R383  39.2E_1%  [RES0402]
R386  39.2E_1%  [RES0402]
R389  39.2E_1%  [RES0402]
R391  39.2E_1%  [RES0402]
R393  39.2E_1%  [RES0402]
R460  10K  [RES0402_0-5]
R462  1K  [RES0201]
R503  1K  [RES0201]
R516  10K  [RES0402_0-5]
R728  0E  [RES0402_0-5]
R730  10K  [RES0402_0-5]
R731  10K  [RES0402_0-5]
R742  39.2E_1%  [RES0402]
TP18  TP40_SMD  [TP40_SMD]
TP39  TP40_SMD  [TP40_SMD]
TP41  TP40_SMD  [TP40_SMD]
TP42  TP40_SMD  [TP40_SMD]
TP44  TP40_SMD  [TP40_SMD]
TP45  TP40_SMD  [TP40_SMD]
TP46  TP40_SMD  [TP40_SMD]
U34  MAXWELL M4  [BGA784_31-49_910X910_1-7]  (part O of 19)
U38  MT40A1G8WE-083E:B  [FBGA78_31-49_320X480_1-2]

### Ports
DDR_A14_WEn (in), DDR_A14_WEn (out), DDR_A15_CAS (in), DDR_A15_CAS (out), DDR_A16_RAS (in), DDR_A16_RAS (out), DDR_A17 (in), DDR_A17 (out), DDR_A[13..0] (out), DDR_ACTn (in), DDR_ACTn (out), DDR_ALERTn (out), DDR_BA0 (in), DDR_BA0 (out), DDR_BA1 (in), DDR_BA1 (out), DDR_BG0 (in), DDR_BG0 (out), DDR_BG1 (in), DDR_BG1 (out), DDR_CKE1 (in), DDR_CKE1 (out), DDR_CKE (in), DDR_CKE (out), DDR_CLKN (in), DDR_CLKN (out), DDR_CLKP (in), DDR_CLKP (out), DDR_CS1n (in), DDR_CS1n (out), DDR_CSn (in), DDR_CSn (out), DDR_DM0 (out), DDR_DM1 (out), DDR_DM2 (out), DDR_DM3 (out), DDR_DM4, DDR_DM4 (out), DDR_DQ[7..0], DDR_DQ[15..8], DDR_DQ[23..16], DDR_DQ[31..24], DDR_DQ[42..36], DDR_DQS0_N (out), DDR_DQS0_P (out), DDR_DQS1_N (out), DDR_DQS1_P (out), DDR_DQS2_N (out), DDR_DQS2_P (out), DDR_DQS3_N (out), DDR_DQS3_P (out), DDR_DQS_N (in), DDR_DQS_N (out), DDR_DQS_P (in), DDR_DQS_P (out), DDR_ODT1 (in), DDR_ODT1 (out), DDR_ODT (in), DDR_ODT (out), DDR_PARITY (in), DDR_PARITY (out), DDR_RESET# (in), DDR_RESET# (out), DDR_TEN (in)

### Nets
DDR_VPP: C181.1 C184.1 C203.1 FL1.2 U38.B1(VPP) U38.M9(VPP)
DDR_VREFCA: C206.1 C597.1 R728.1 U38.J1(VREFCA)
DGND: C30.2 C31.2 C32.2 C33.2 C34.2 C35.2 C36.2 C52.2 C57.2 C64.2 C65.2 C67.2 C70.2 C71.2 C181.2 C182.2 C183.2 C184.2 C185.2 C190.2 C202.2 C203.2 C204.2 C205.2 C206.2 C207.2 C328.2 C504.2 C505.2 C579.2 C583.2 C585.2 C593.2 C594.2 C597.2 R186.2 R212.2 R219.1 R462.1 R730.2 R731.2 U38.A2(VSSQ) U38.A8(VSSQ) U38.A9(VSS) U38.C8(VSS) U38.D1(VSSQ) U38.D9(VSSQ) U38.E1(VSS) U38.E9(VSS) U38.G1(VSS) U38.H9(VSS) U38.K1(VSS) U38.K9(VSS) U38.N1(VSS)
SoC_DDR_VREFCA: C504.1 C505.1 R728.2 U34.F12(DDR_VREF0)
VCC_2V5: FL1.1
VDD_DDR4: C182.1 C183.1 C185.1 C190.1 C202.1 C204.1 C205.1 C207.1 C303.1 C579.1 C583.1 C585.1 C593.1 C594.1 R182.2 R220.2 R460.2 R503.2 R516.1 U38.A1(VDD) U38.B2(VDDQ) U38.B8(VDDQ) U38.C1(VDDQ) U38.C7(VDD) U38.C9(VDDQ) U38.E2(VDDQ) U38.E8(VDDQ) U38.F1(VDD) U38.F9(VDD) U38.H1(VDD) U38.J9(VDD) U38.M1(VDD) U38.N9(VDD)
VDDR_VTT: C30.1 C31.1 C32.1 C33.1 C34.1 C35.1 C36.1 C52.1 C57.1 C64.1 C65.1 C67.1 C70.1 C71.1 C328.1 R43.2 R44.2 R45.2 R46.2 R47.2 R48.2 R49.2 R56.2 R57.2 R61.2 R63.2 R67.2 R69.2 R70.2 R366.2 R367.2 R368.2 R369.2 R370.2 R371.2 R372.2 R377.2 R379.2 R382.2 R383.2 R386.2 R389.2 R391.2 R393.2 R742.2
DDR_A0: R389.1 U34.A10(DDR_AC0) U38.L3(A0)
DDR_A1: R43.1 U34.D9(DDR_AC1) U38.L7(A1)
DDR_A2: R393.1 U34.C9(DDR_AC2) U38.M3(A2)
DDR_A3: R369.1 U34.E9(DDR_AC3) U38.K7(A3)
DDR_A4: R386.1 U34.A9(DDR_AC4) U38.K3(A4)
DDR_A5: R368.1 U34.E8(DDR_AC5) U38.L8(A5)
DDR_A6: R67.1 U34.F8(DDR_AC6) U38.L2(A6)
DDR_A7: R49.1 U34.C7(DDR_AC7) U38.M8(A7)
DDR_A8: R69.1 U34.C8(DDR_AC8) U38.M2(A8)
DDR_A9: R367.1 U34.D7(DDR_AC9) U38.M7(A9)
DDR_A10: R383.1 U34.E7(DDR_AC10) U38.J3(A10/AP)
DDR_A11: R70.1 U34.A6(DDR_AC11) U38.N2(A11)
DDR_A12: R370.1 U34.F7(DDR_AC12) U38.J7(A12/BC_N)
DDR_A13: R44.1 U34.D6(DDR_AC13) U38.N8(A13)
DDR_A14_WEn: R382.1 U34.C6(DDR_AC14) U38.H2(WE_N/A14) ; port DDR_A14_WEn
DDR_A15_CAS: R46.1 U34.F6(DDR_AC15) U38.H7(CAS_N/A15) ; port DDR_A15_CAS
DDR_A16_RAS: R371.1 U34.E6(DDR_AC16) U38.H8(RAS_N/A16) ; port DDR_A16_RAS
DDR_A17: R366.1 U34.E5(DDR_AC17) U38.N7(A17/NF) ; port DDR_A17
DDR_ACTn: R742.1 U34.D8(DDR_AC18) U38.H3(ACT_N) ; port DDR_ACTn
DDR_ALERTn: R460.1 U34.D5(DDR_ALERT_N) U38.L9(ALERT_N) ; port DDR_ALERTn
DDR_BA0: R63.1 U34.D10(DDR_AC19) U38.K2(BA0) ; port DDR_BA0
DDR_BA1: R48.1 U34.E10(DDR_AC20) U38.K8(BA1) ; port DDR_BA1
DDR_BG0: R61.1 U34.C10(DDR_AC21) U38.J2(BG0) ; port DDR_BG0
DDR_BG1: R47.1 U34.F11(DDR_AC22) U38.J8(BG1) ; port DDR_BG1
DDR_CKE: R57.1 R731.1 U34.C11(DDR_AC26) U38.G3(CKE) ; port DDR_CKE
DDR_CKE1: R379.1 R730.1 U34.D12(DDR_AC29) U38.G2(C0/CKE1) ; port DDR_CKE1
DDR_CLKN: R374.1 U34.B8(DDR_CK0_N) U38.F8(CK_C) ; port DDR_CLKN
DDR_CLKP: R373.1 U34.A8(DDR_CK0) U38.F7(CK_T) ; port DDR_CLKP
DDR_CS1n: R45.1 U34.E11(DDR_AC27) U38.G8(C1/CS1_N) ; port DDR_CS1n
DDR_CSn: R372.1 U34.D11(DDR_AC24) U38.G7(CS_N) ; port DDR_CSn
DDR_DM0: U34.E1(DDR_DQDM8) ; port DDR_DM0
DDR_DM1: U34.C5(DDR_DQDM17) ; port DDR_DM1
DDR_DM2: U34.D14(DDR_DQDM26) ; port DDR_DM2
DDR_DM3: U34.B17(DDR_DQDM35) ; port DDR_DM3
DDR_DM4: U34.C17(DDR_DQDM43) U38.A7(NF/NF/DM_N/DBI_N/TDQS_T) ; port DDR_DM4
DDR_DQ0: U34.A3(DDR_DQDM0)
DDR_DQ1: U34.B2(DDR_DQDM1)
DDR_DQ2: U34.C2(DDR_DQDM2)
DDR_DQ3: U34.D2(DDR_DQDM3)
DDR_DQ4: U34.E2(DDR_DQDM4)
DDR_DQ5: U34.G1(DDR_DQDM5)
DDR_DQ6: U34.F2(DDR_DQDM6)
DDR_DQ7: U34.F1(DDR_DQDM7)
DDR_DQ8: U34.E3(DDR_DQDM9)
DDR_DQ9: U34.C3(DDR_DQDM10)
DDR_DQ10: U34.D3(DDR_DQDM11)
DDR_DQ11: U34.B3(DDR_DQDM12)
DDR_DQ12: U34.D4(DDR_DQDM13)
DDR_DQ13: U34.C4(DDR_DQDM14)
DDR_DQ14: U34.B4(DDR_DQDM15)
DDR_DQ15: U34.B5(DDR_DQDM16)
DDR_DQ16: U34.E13(DDR_DQDM18)
DDR_DQ17: U34.C14(DDR_DQDM19)
DDR_DQ18: U34.B14(DDR_DQDM20)
DDR_DQ19: U34.A14(DDR_DQDM21)
DDR_DQ20: U34.E14(DDR_DQDM22)
DDR_DQ21: U34.B13(DDR_DQDM23)
DDR_DQ22: U34.C13(DDR_DQDM24)
DDR_DQ23: U34.D13(DDR_DQDM25)
DDR_DQ24: U34.D15(DDR_DQDM27)
DDR_DQ25: U34.C15(DDR_DQDM28)
DDR_DQ26: U34.E16(DDR_DQDM29)
DDR_DQ27: U34.E15(DDR_DQDM30)
DDR_DQ28: U34.D16(DDR_DQDM31)
DDR_DQ29: U34.B16(DDR_DQDM32)
DDR_DQ30: U34.C16(DDR_DQDM33)
DDR_DQ31: U34.A17(DDR_DQDM34)
DDR_DQ36: U34.B19(DDR_DQDM36) U38.C2(DQ0)
DDR_DQ37: U34.B18(DDR_DQDM37) U38.B7(DQ1)
DDR_DQ38: U34.C18(DDR_DQDM38) U38.D3(DQ2)
DDR_DQ39: U34.D18(DDR_DQDM39) U38.D7(DQ3)
DDR_DQ40: U34.E18(DDR_DQDM40) U38.D2(DQ4/NC)
DDR_DQ41: U34.E17(DDR_DQDM41) U38.D8(DQ5/NC)
DDR_DQ42: U34.D17(DDR_DQDM42) U38.E3(DQ6/NC)
DDR_DQS0_N: U34.C1(DDR_DQS0_N) ; port DDR_DQS0_N
DDR_DQS0_P: U34.D1(DDR_DQS0) ; port DDR_DQS0_P
DDR_DQS1_N: U34.A4(DDR_DQS1_N) ; port DDR_DQS1_N
DDR_DQS1_P: U34.A5(DDR_DQS1) ; port DDR_DQS1_P
DDR_DQS2_N: U34.A12(DDR_DQS2_N) ; port DDR_DQS2_N
DDR_DQS2_P: U34.A13(DDR_DQS2) ; port DDR_DQS2_P
DDR_DQS3_N: U34.A16(DDR_DQS3_N) ; port DDR_DQS3_N
DDR_DQS3_P: U34.A15(DDR_DQS3) ; port DDR_DQS3_P
DDR_DQS_N: U34.A18(DDR_DQS4_N) U38.B3(DQS_C) ; port DDR_DQS_N
DDR_DQS_P: U34.A19(DDR_DQS4) U38.C3(DQS_T) ; port DDR_DQS_P
DDR_ODT: R377.1 U34.B11(DDR_AC25) U38.F3(ODT) ; port DDR_ODT
DDR_ODT1: R56.1 U34.E12(DDR_AC28) U38.F2(C2/ODT1) ; port DDR_ODT1
DDR_PARITY: R391.1 U34.B10(DDR_AC23) U38.N3(PAR) ; port DDR_PARITY
DDR_RESET#: R165.1 R171.1 R219.2 R220.1 U38.L1(RESET_N) ; port DDR_RESET#
DDR_RESET_FS: R171.2 R182.1 U34.F16(DDR_FS_RESET_N)
DDR_TEN: R462.2 R503.1 U38.G9(TEN) ; port DDR_TEN
NetC303_2: C303.2 R373.2 R374.2
NetR165_2: R165.2 U34.A11(DDR_RESET_N)
NetR186_1: R186.1 U34.F13(DDR_VTP)
NetR212_1: R212.1 U38.B9(ZQ)
NetR516_2: R516.2 U38.E7(DQ7/NC)
NetTP18_1: TP18.1(TP) U38.A3(NF/NF/TDQS_C/NF)
NetTP39_1: TP39.1(TP) U34.B7(DDR_CK1_N)
NetTP41_1: TP41.1(TP) U34.A7(DDR_CK1)
NetTP42_1: TP42.1(TP) U34.F9(DDR_DTESTOUT0)
NetTP44_1: TP44.1(TP) U34.F10(DDR_DTESTOUT1)
NetTP45_1: TP45.1(TP) U34.C12(DDR_ATESTOUTO)
NetTP46_1: TP46.1(TP) U34.F15(DDR_VREF_ZQ)

### Layout directives
net class DDR_BANK0: DDR_DM0, DDR_DQ0, DDR_DQ1, DDR_DQ2, DDR_DQ3, DDR_DQ4, DDR_DQ5, DDR_DQ6, DDR_DQ7
net class DDR_BANK1: DDR_DM1, DDR_DQ8, DDR_DQ9, DDR_DQ10, DDR_DQ11, DDR_DQ12, DDR_DQ13, DDR_DQ14, DDR_DQ15
net class DDR_BANK2: DDR_DM2, DDR_DQ16, DDR_DQ17, DDR_DQ18, DDR_DQ19, DDR_DQ20, DDR_DQ21, DDR_DQ22, DDR_DQ23
net class DDR_BANK3: DDR_DM3, DDR_DQ24, DDR_DQ25, DDR_DQ26, DDR_DQ27, DDR_DQ28, DDR_DQ29, DDR_DQ30, DDR_DQ31
net class DDR_ECC: DDR_DM4, DDR_DQ36, DDR_DQ37, DDR_DQ38, DDR_DQ39, DDR_DQ40, DDR_DQ41, DDR_DQ42
net class DDR_ADDR_CTRL: DDR_A0, DDR_A1, DDR_A2, DDR_A3, DDR_A4, DDR_A5, DDR_A6, DDR_A7, DDR_A8, DDR_A9, DDR_A10, DDR_A11, DDR_A12, DDR_A13, DDR_A14_WEn, DDR_A15_CAS, DDR_A16_RAS, DDR_A17, DDR_ACTn, DDR_BA0, DDR_BA1, DDR_BG0, DDR_BG1, DDR_CKE, DDR_CKE1, DDR_CLKN, DDR_CLKP, DDR_CS1n, DDR_CSn, DDR_ODT, DDR_ODT1, DDR_PARITY
net class DDR_DRAM_CLK: DDR_CLKN, DDR_CLKP, DDR_DQS0_N, DDR_DQS0_P, DDR_DQS1_N, DDR_DQS1_P, DDR_DQS2_N, DDR_DQS2_P, DDR_DQS3_N, DDR_DQS3_P, DDR_DQS_N, DDR_DQS_P

### Notes on the sheet
- SoC DDR INTERFACE
- DDR_DRAM_CLK
- ECC DEVICE
- DDR TERMINATION
- (in symbol AM654X_BGA784, part O) DDR
- (in symbol MISTRAL_TITLEBLK_CSIZE) Title; Designed for TI by Mistral Solutions Pvt Ltd; Size; Rev; Date:; Sheet; of

### Library data of the parts
*#16 = MISTRAL_TITLEBLK_CSIZE: Issue: 1.0; Page Create Date: March  8, 1995; Page Modify Date: *
C30 C32 C33 C36 C57 C64 C70 C71 C328 = CAP_Dup3: CAP CERAMIC 0.1uF 16V 10% X5R 0201; Mistral Part No: 120009030072-R; Mfr_name: MURATA; Mfr_part_number: GRM033R61C104KE84J; Part_type: CAPACITORS\CERAMIC; Project: TI_MAXIE_CPB; Customs_HS_Code: 85322990; Custom_Duty: 15%; Wattage: NA; Library Ref: CAP; Tolerance: 10%; Voltage: 16V; Package: 0201; Distributor_name: DIGIKEY; Distributor_part_number: 490-16742-1-ND; Height: 0.33MM; Datasheet: Y:\MIS_DATABASE\DATASHEETS\CAPACITORS\GRM033R61C104KE84.PDF; Crtd /date: MANIRAJA/120218; Chkd/date: MANIRAJA/120218; Weight: 0.33mg; Temperature: -55°C+85°C; MECHANICAL 3D STEP FILE: CAP0201_0-5; PCB Footprint: CAP0201_0-5
C31 C35 C303 = CAP_Dup3: CAP CERAMIC 0.1uF 16V 10% X5R 0201; Part_type: CAPACITORS\CERAMIC; Mfr_part_number: GRM033R61C104KE84J; Mfr_name: MURATA; Mistral Part No: 120009030072-R; Wattage: NA; Custom_Duty: 15%; Customs_HS_Code: 85322990; Project: TI_MAXIE_CPB; Library Ref: CAP; MECHANICAL 3D STEP FILE: CAP0201_0-5; Temperature: -55°C+85°C; Weight: 0.33mg; Chkd/date: MANIRAJA/120218; Crtd /date: MANIRAJA/120218; Datasheet: Y:\MIS_DATABASE\DATASHEETS\CAPACITORS\GRM033R61C104KE84.PDF; Height: 0.33MM; Distributor_part_number: 490-16742-1-ND; Distributor_name: DIGIKEY; Package: 0201; Voltage: 16V; Tolerance: 10%; PCB Footprint: CAP0201_0-5
C34 C52 C65 C67 = CAP_Dup3: CAP CERAMIC 0.1uF 16V 10% X5R 0201; Mistral Part No: 120009030072-R; Mfr_name: MURATA; Mfr_part_number: GRM033R61C104KE84J; Part_type: CAPACITORS\CERAMIC; Wattage: NA; Project: TI_MAXIE_CPB; Customs_HS_Code: 85322990; Custom_Duty: 15%; Library Ref: CAP; MECHANICAL 3D STEP FILE: CAP0201_0-5; Temperature: -55°C+85°C; Weight: 0.33mg; Tolerance: 10%; Voltage: 16V; Package: 0201; Distributor_name: DIGIKEY; Distributor_part_number: 490-16742-1-ND; Height: 0.33MM; Datasheet: Y:\MIS_DATABASE\DATASHEETS\CAPACITORS\GRM033R61C104KE84.PDF; Crtd /date: MANIRAJA/120218; Chkd/date: MANIRAJA/120218; PCB Footprint: CAP0201_0-5
C181 C190 = CAP_Dup3: CAP CERAMIC 22uF 6.3V 20% X5R 0603; Mistral Part No: 120015090007-R; Mfr_name: MURATA; Mfr_part_number: GRM188R60J226MEA0; Part_type: CAPACITORS\CERAMIC; Alternate_mfr_name_A: YAGEO AMERICA; Alternate_mfr_part_number_A: CC0603MRX5R5BB226; Project: OCTBTS_3000; Wattage: NA; Customs_HS_Code: 85322990; Custom_Duty: 15%; PCB Footprint: CAP0603; Library Ref: CAP; Tolerance: 20%; Voltage: 6.3V; Package: 0603; Distributor_name: DIGIKEY; Distributor_part_number: 490-7611-2-ND; Height: 1.00MM; Weight: NA; Temperature: -55°C+85°C; Datasheet: Y:\MIS_DATABASE\DATASHEETS\CAPACITORS\GRM188SERIES.PDF; Crtd /date: JEBRAN/090915; Chkd/date: JEBRAN/090915; Distributor_name_A: DIGIKEY; Distributor_part_number_A: 311-1815-1-ND
C182-C185 C202 C203 C205-C207 C504 C505 C579 C583 C585 C593 C594 C597 = CAP_Dup3: as C82 on sheet 15-DDR4 DEVICES; Library Ref: CAP; MECHANICAL 3D STEP FILE: CAP0201_0-5; Temperature: -55°C+85°C; Weight: 0.33mg; PCB Footprint: CAP0201_0-5; Chkd/date: MANIRAJA/230118; Crtd /date: MANIRAJA/230118; Datasheet: Y:\MIS_DATABASE\DATASHEETS\CAPACITORS\GRM033R61E103KA12.PDF; Height: 0.33MM; Distributor_part_number: GRM033R61E103KA12J-ND; Distributor_name: DIGIKEY; Package: 0201; Voltage: 25V; Tolerance: 10%
C204 = CAP_Dup3: as C44 on sheet 15-DDR4 DEVICES; Library Ref: CAP; MECHANICAL 3D STEP FILE: CAP0201_0-5; Temperature: -55°C+85°C; Weight: 0.33mg; PCB Footprint: CAP0201_0-5; Tolerance: 10%; Voltage: 25V; Package: 0201; Distributor_name: DIGIKEY; Distributor_part_number: GRM033R61E103KA12J-ND; Height: 0.33MM; Datasheet: Y:\MIS_DATABASE\DATASHEETS\CAPACITORS\GRM033R61E103KA12.PDF; Crtd /date: MANIRAJA/230118; Chkd/date: MANIRAJA/230118
FL1 = EMIFILTER_IND: FERRITE CHIP 120E 1.3A 0402; Mistral Part No: 130012030043-R; Mfr_name: MURATA; Mfr_part_number: BLM15PD121SN1; Part_type: MISC\FILTER; Project: GEN_3-8; Tolerance: 25%; Voltage: NA; Customs_HS_Code: 85437099; Custom_Duty: 24%; Footprint Path: Y:\MIS_DATABASE\Library\ALTIUM_TOOL\PCB_FOOTPRINTS\Altium_Footprint_Lib.PcbLib; Library Path: Y:\MIS_DATABASE\Library\ALTIUM_TOOL\SCHEMATICS_PARTS\MS_FILTER_Library.schlib; Footprint Ref: EMIFIL_BLM15A_0402_0-6; Library Ref: EMIFILTER_IND; Wattage: NA; Package: 0402; Distributor_name: DIGIKEY; Distributor_part_number: 490-5203-1-ND; Height: 0.55MM; Weight: 0.65mg; Temperature: -55°C+125°C; Datasheet: Y:\MIS_DATABASE\DATASHEETS\DISCRETES\INDUCTORS\BLM18K-SERIES.PDF; Crtd /date: CHAITHANYA/150312; Chkd/date: VASANTHA/010117; MECHANICAL 3D STEP FILE: EMIFIL_BLM15A_0402_0-6; PCB Footprint: EMIFIL_BLM15A_0402_0-6
R43 R44 R47 R49 R67 R69 R70 R366 R368-R371 R377 R382 R386 R391 R393 = RESISTOR_Dup5: RES 39.2E 1/16W 1% 0402; Mistral Part No: 110011040030-R; Mfr_name: STACKPOLE ELECTRONICS; Mfr_part_number: RMCF0402FT39R2; Part_type: RESISTORS\FIXED; Project: AOD_POD-BASECARD; Voltage: NA; Customs_HS_Code: 85332119; Custom_Duty: 15%; Library Ref: RESISTOR; Tolerance: 1%; Wattage: 1/16W; Package: 0402; Distributor_name: DIGIKEY; Distributor_part_number: RMCF0402FT39R2CT-ND; Height: 0.40MM; Weight: NA; Temperature: -55°C+155°C; Datasheet: Y:\MIS_DATABASE\DATASHEETS\RESISTORS\RMCF-SERIES.PDF; Crtd /date: MAZHAR/210411; Chkd/date: RAGESH/210411; PCB Footprint: RES0402
R45 R46 R48 R56 R57 R61 R63 R367 R372-R374 R379 R383 R389 R742 = RESISTOR_Dup5: RES 39.2E 1/16W 1% 0402; Part_type: RESISTORS\FIXED; Mfr_part_number: RMCF0402FT39R2; Mfr_name: STACKPOLE ELECTRONICS; Mistral Part No: 110011040030-R; Custom_Duty: 15%; Customs_HS_Code: 85332119; Voltage: NA; Project: AOD_POD-BASECARD; Library Ref: RESISTOR; Chkd/date: RAGESH/210411; Crtd /date: MAZHAR/210411; Datasheet: Y:\MIS_DATABASE\DATASHEETS\RESISTORS\RMCF-SERIES.PDF; Temperature: -55°C+155°C; Weight: NA; Height: 0.40MM; Distributor_part_number: RMCF0402FT39R2CT-ND; Distributor_name: DIGIKEY; Package: 0402; Wattage: 1/16W; Tolerance: 1%; PCB Footprint: RES0402
R165 = RESISTOR_Dup2: RES 0E 1/16W 0402; Mistral Part No: 110010080019-P; Mfr_name: VISHAY; Mfr_part_number: CRCW04020000Z0ED; Part_type: RESISTORS\FIXED; Voltage: NA; Project: PB_BUGBASE; Customs_HS_Code: 85332119; Custom_Duty: 15%; Footprint Path: Y:\MIS_DATABASE\Library\ALTIUM_TOOL\PCB_FOOTPRINTS\Altium_Footprint_Lib.PcbLib; Library Path: Y:\MIS_DATABASE\Library\ALTIUM_TOOL\SCHEMATICS_PARTS\MS_DISCRETE_Library.schlib; Footprint Ref: RES0402_0-5; Library Ref: RESISTOR; PCB Footprint: RES0402_0-5; MECHANICAL 3D STEP FILE: RES0402_0-5; Temperature: -55°C+155°C; Weight: 0.65g/1000pcs; Tolerance: NA; Wattage: 1/16W; Package: 0402; Distributor_name: DIGIKEY; Distributor_part_number: 541-0.0JCT-ND; Height: 0.40MM; Datasheet: Y:\MIS_DATABASE\DATASHEETS\RESISTORS\CRCW0603.PDF; Crtd /date: MUDDU/190810; Chkd/date: VASANTHA/201216; RoHS: Pb-Free
R171 = RESISTOR_Dup2: RES 0E 1/16W 0402; Part_type: RESISTORS\FIXED; Mfr_part_number: CRCW04020000Z0ED; Mfr_name: VISHAY; Mistral Part No: 110010080019-P; Custom_Duty: 15%; Customs_HS_Code: 85332119; Tolerance: NA; Project: PB_BUGBASE; NI_MARK: DNI; Footprint Path: Y:\MIS_DATABASE\Library\ALTIUM_TOOL\PCB_FOOTPRINTS\Altium_Footprint_Lib.PcbLib; Library Path: Y:\MIS_DATABASE\Library\ALTIUM_TOOL\SCHEMATICS_PARTS\MS_DISCRETE_Library.schlib; Footprint Ref: RES0402_0-5; Library Ref: RESISTOR; PCB Footprint: RES0402_0-5; RoHS: Pb-Free; Chkd/date: VASANTHA/201216; Crtd /date: MUDDU/190810; Datasheet: Y:\MIS_DATABASE\DATASHEETS\RESISTORS\CRCW0603.PDF; Height: 0.40MM; Distributor_part_number: 541-0.0JCT-ND; Distributor_name: DIGIKEY; Package: 0402; Wattage: 1/16W; Voltage: NA; Weight: 0.65g/1000pcs; Temperature: -55°C+155°C; MECHANICAL 3D STEP FILE: RES0402_0-5
R182 R220 = RESISTOR_Dup5: RES 2.2K 1/16W 5% 0402; Part_type: RESISTORS\FIXED; Mfr_part_number: RC0402JR-072K2L; Mfr_name: YAGEO AMERICA; Mistral Part No: 110010120018-R; Custom_Duty: 15%; Customs_HS_Code: 85332119; Voltage: NA; Project: TE4; Library Ref: RESISTOR; PCB Footprint: RES0402_0-5; MECHANICAL 3D STEP FILE: RES0402_0-5; Chkd/date: VASANTHA/061216; Crtd /date: BAVISH/021210; Datasheet: Y:\MIS_DATABASE\DATASHEETS\RESISTORS\YAGEO.PDF; Temperature: -55°C+155°C; Weight: 0.65mg; Height: 0.40MM; Distributor_part_number: 311-2.2KJRCT-ND; Distributor_name: DIGIKEY; Package: 0402; Wattage: 1/16W; Tolerance: 5%; Footprint Path: VALUE IS VAILABLE 3 TIMES
R186 = RESISTOR_Dup1: as R52 on sheet 15-DDR4 DEVICES; Library Ref: RESISTOR; Chkd/date: MAZHAR/150611; Crtd /date: BAVISH/020611; Datasheet: Y:\MIS_DATABASE\DATASHEETS\RESISTORS\ERJ-2R.PDF; Temperature: -55°C+125°C; Weight: 0.8/1000g; Height: 0.40MM; Distributor_part_number: P240LCT-ND; Distributor_name: DIGIKEY; Package: 0402; Wattage: 1/10W; Tolerance: 1%; PCB Footprint: RES0402
R212 = RESISTOR_Dup1: as R117 on sheet 15-DDR4 DEVICES; Library Ref: RESISTOR; PCB Footprint: RES0402; Tolerance: 1%; Wattage: 1/10W; Package: 0402; Distributor_name: DIGIKEY; Distributor_part_number: P240LCT-ND; Height: 0.40MM; Weight: 0.8/1000g; Temperature: -55°C+125°C; Datasheet: Y:\MIS_DATABASE\DATASHEETS\RESISTORS\ERJ-2R.PDF; Crtd /date: BAVISH/020611; Chkd/date: MAZHAR/150611
R219 = RESISTOR_Dup5: RES 2.2K 1/16W 5% 0402; Part_type: RESISTORS\FIXED; Mfr_part_number: RC0402JR-072K2L; Mfr_name: YAGEO AMERICA; Mistral Part No: 110010120018-R; Custom_Duty: 15%; Customs_HS_Code: 85332119; Voltage: NA; Project: TE4; NI_MARK: DNI; Library Ref: RESISTOR; PCB Footprint: RES0402_0-5; MECHANICAL 3D STEP FILE: RES0402_0-5; Chkd/date: VASANTHA/061216; Crtd /date: BAVISH/021210; Datasheet: Y:\MIS_DATABASE\DATASHEETS\RESISTORS\YAGEO.PDF; Temperature: -55°C+155°C; Weight: 0.65mg; Height: 0.40MM; Distributor_part_number: 311-2.2KJRCT-ND; Distributor_name: DIGIKEY; Package: 0402; Wattage: 1/16W; Tolerance: 5%; Footprint Path: VALUE IS VAILABLE 3 TIMES
R460 = RESISTOR_Dup5: RES 10K 1/16W 5% 0402; Mistral Part No: 110009030208-R; Mfr_name: YAGEO AMERICA; Mfr_part_number: RC0402JR-0710KL; Part_type: RESISTORS\FIXED; Project: HSE; Voltage: NA; Customs_HS_Code: 85332119; Custom_Duty: 15%; Footprint Path: Y:\MIS_DATABASE\Library\ALTIUM_TOOL\PCB_FOOTPRINTS\Altium_Footprint_Lib.PcbLib; Library Path: Y:\MIS_DATABASE\Library\ALTIUM_TOOL\SCHEMATICS_PARTS\MS_DISCRETE_Library.schlib; Footprint Ref: RES0402_0-5; Library Ref: RESISTOR; PCB Footprint: RES0402_0-5; Tolerance: 5%; Wattage: 1/16W; Package: 0402; Distributor_name: DIGIKEY; Distributor_part_number: 311-10KJRCT-ND; Height: 0.40MM; Weight: 0.65mg; Temperature: -55°C+155°C; Datasheet: Y:\MIS_DATABASE\DATASHEETS\RESISTORS\YAGEO-RC0402.PDF; Crtd /date: MAZHAR/230805; Chkd/date: VASANTHA/061216; RoHS: Pb-Free; MECHANICAL 3D STEP FILE: RES0402_0-5
R462 = RESISTOR_Dup4: RES 1K 1/20W 5% 0201; Mistral Part No: 110015080014-R; Mfr_name: VISHAY; Mfr_part_number: CRCW02011K00FKED; Part_type: RESISTORS\FIXED; Project: OCTASIC_3000; Voltage: NA; Customs_HS_Code: 85332119; Custom_Duty: 15%; Library Ref: RESISTOR; Tolerance: 5%; Wattage: 1/20W; Package: 0201; Distributor_name: DIGIKEY; Distributor_part_number: 541-1.00KAABCT-ND; Height: 0.28MM; Weight: NA; Temperature: -55°C+155°C; Datasheet: Y:\MIS_DATABASE\DATASHEETS\RESISTORS\CRCW0201.PDF; Crtd /date: JEBRAN/110815; Chkd/date: JEBRAN/110815; PCB Footprint: RES0201
R503 = RESISTOR_Dup4: RES 1K 1/20W 5% 0201; Mistral Part No: 110015080014-R; Mfr_name: VISHAY; Mfr_part_number: CRCW02011K00FKED; Part_type: RESISTORS\FIXED; Project: OCTASIC_3000; Voltage: NA; Customs_HS_Code: 85332119; Custom_Duty: 15%; NI_MARK: DNI; Library Ref: RESISTOR; Tolerance: 5%; Wattage: 1/20W; Package: 0201; Distributor_name: DIGIKEY; Distributor_part_number: 541-1.00KAABCT-ND; Height: 0.28MM; Weight: NA; Temperature: -55°C+155°C; Datasheet: Y:\MIS_DATABASE\DATASHEETS\RESISTORS\CRCW0201.PDF; Crtd /date: JEBRAN/110815; Chkd/date: JEBRAN/110815; PCB Footprint: RES0201
R516 = RESISTOR_Dup5: RES 10K 1/16W 5% 0402; Part_type: RESISTORS\FIXED; Mfr_part_number: RC0402JR-0710KL; Mfr_name: YAGEO AMERICA; Mistral Part No: 110009030208-R; Custom_Duty: 15%; Customs_HS_Code: 85332119; Voltage: NA; Project: HSE; Footprint Path: Y:\MIS_DATABASE\Library\ALTIUM_TOOL\PCB_FOOTPRINTS\Altium_Footprint_Lib.PcbLib; Library Path: Y:\MIS_DATABASE\Library\ALTIUM_TOOL\SCHEMATICS_PARTS\MS_DISCRETE_Library.schlib; Footprint Ref: RES0402_0-5; Library Ref: RESISTOR; PCB Footprint: RES0402_0-5; MECHANICAL 3D STEP FILE: RES0402_0-5; RoHS: Pb-Free; Chkd/date: VASANTHA/061216; Crtd /date: MAZHAR/230805; Datasheet: Y:\MIS_DATABASE\DATASHEETS\RESISTORS\YAGEO-RC0402.PDF; Temperature: -55°C+155°C; Weight: 0.65mg; Height: 0.40MM; Distributor_part_number: 311-10KJRCT-ND; Distributor_name: DIGIKEY; Package: 0402; Wattage: 1/16W; Tolerance: 5%
R728 = RESISTOR_Dup5: RES 0E 1/16W 0402; Mistral Part No: 110010080019-P; Mfr_name: VISHAY; Mfr_part_number: CRCW04020000Z0ED; Part_type: RESISTORS\FIXED; Project: PB_BUGBASE; Tolerance: NA; Customs_HS_Code: 85332119; Custom_Duty: 15%; NI_MARK: DNI; Footprint Path: Y:\MIS_DATABASE\Library\ALTIUM_TOOL\PCB_FOOTPRINTS\Altium_Footprint_Lib.PcbLib; Library Path: Y:\MIS_DATABASE\Library\ALTIUM_TOOL\SCHEMATICS_PARTS\MS_DISCRETE_Library.schlib; Footprint Ref: RES0402_0-5; Library Ref: RESISTOR; PCB Footprint: RES0402_0-5; Voltage: NA; Wattage: 1/16W; Package: 0402; Distributor_name: DIGIKEY; Distributor_part_number: 541-0.0JCT-ND; Height: 0.40MM; Weight: 0.65g/1000pcs; Temperature: -55°C+155°C; Datasheet: Y:\MIS_DATABASE\DATASHEETS\RESISTORS\CRCW0603.PDF; Crtd /date: MUDDU/190810; Chkd/date: VASANTHA/201216; RoHS: Pb-Free; MECHANICAL 3D STEP FILE: RES0402_0-5
R730 R731 = RESISTOR_Dup5: RES 10K 1/16W 5% 0402; Mistral Part No: 110009030208-R; Mfr_name: YAGEO AMERICA; Mfr_part_number: RC0402JR-0710KL; Part_type: RESISTORS\FIXED; Project: HSE; Voltage: NA; Customs_HS_Code: 85332119; Custom_Duty: 15%; NI_MARK: DNI; Footprint Path: Y:\MIS_DATABASE\Library\ALTIUM_TOOL\PCB_FOOTPRINTS\Altium_Footprint_Lib.PcbLib; Library Path: Y:\MIS_DATABASE\Library\ALTIUM_TOOL\SCHEMATICS_PARTS\MS_DISCRETE_Library.schlib; Footprint Ref: RES0402_0-5; Library Ref: RESISTOR; PCB Footprint: RES0402_0-5; Tolerance: 5%; Wattage: 1/16W; Package: 0402; Distributor_name: DIGIKEY; Distributor_part_number: 311-10KJRCT-ND; Height: 0.40MM; Weight: 0.65mg; Temperature: -55°C+155°C; Datasheet: Y:\MIS_DATABASE\DATASHEETS\RESISTORS\YAGEO-RC0402.PDF; Crtd /date: MAZHAR/230805; Chkd/date: VASANTHA/061216; RoHS: Pb-Free; MECHANICAL 3D STEP FILE: RES0402_0-5
TP18 TP39 TP45 = TESTPOINT: TESTPOINT CIR 40 SMD; Mfr_name: LOCAL; Mistral Part No: 130009030933; MECHANICAL 3D STEP FILE: NA; Project: RAINIER-3; NI_MARK: DNI; Footprint Ref: TP40_SMD; Library Ref: TESTPOINT; Footprint Path: Y:\MIS_DATABASE\Library\ALTIUM_TOOL\PCB_FOOTPRINTS\Altium_Footprint_Lib.PcbLib; Library Path: Y:\MIS_DATABASE\Library\ALTIUM_TOOL\SCHEMATICS_PARTS\MS_DISCRETE_Library.schlib; Datasheet: NA; Temperature: NA; Weight: NA; Wattage: NA; Voltage: NA; Tolerance: NA; PCB Footprint: TP40_SMD; Chkd/date: MAZHAR/190505; Crtd /date: MAZHAR/190505; Height: NA; Distributor_part_number: NA; Distributor_name: NA; Package: SMD; Part_type: TESTPOINT; Mfr_part_number: TP40_SMD; RoHS: NA
TP41 TP42 TP44 TP46 = TESTPOINT: as TP8 on sheet 15-DDR4 DEVICES; Footprint Ref: TP40_SMD; Library Ref: TESTPOINT; Footprint Path: Y:\MIS_DATABASE\Library\ALTIUM_TOOL\PCB_FOOTPRINTS\Altium_Footprint_Lib.PcbLib; Library Path: Y:\MIS_DATABASE\Library\ALTIUM_TOOL\SCHEMATICS_PARTS\MS_DISCRETE_Library.schlib; Datasheet: NA; Temperature: NA; Weight: NA; Wattage: NA; Voltage: NA; Tolerance: NA; Mfr_part_number: TP40_SMD; Part_type: TESTPOINT; Package: SMD; Distributor_name: NA; Distributor_part_number: NA; Height: NA; Crtd /date: MAZHAR/190505; Chkd/date: MAZHAR/190505; PCB Footprint: TP40_SMD; RoHS: NA
U34 = AM654X_BGA784: IC MAXWELL MICRO CONTROLLER UNIT BGA784; Mistral Part No: 141217100003; Mfr_name: TEXAS INSTRUMENTS; Mfr_part_number: MAXWELL M4_EVM; Part_type: ICS\DIGITAL\MICROCONTROLLER; Project: TI_MAXIE_CPB; Tolerance: NA; Customs_HS_Code: 85423100; Custom_Duty: 15%; Library Ref: AM654X_BGA784; Voltage: NA; Wattage: NA; Package: BGA784; Distributor_name: NA; Distributor_part_number: NA; Height: 1.63MM; Weight: NA; Temperature: NA; Datasheet: Y:\MIS_DATABASE\DATASHEETS\ICS\DIGITAL\MICROCONTROLLER\MAXWELLM4.PDF; Crtd /date: MANIRAJA/130717; Chkd/date: MANIRAJA/130717; MECHANICAL 3D STEP FILE: BGA784_31-49_910X910_1-7; PCB Footprint: BGA784_31-49_910X910_1-7
U38 = MT40A1G8WE-083_FBGA78: as U25 on sheet 15-DDR4 DEVICES; Library Ref: MT40A1G8WE-083_FBGA78; PCB Footprint: FBGA78_31-49_320X480_1-2; Mfr_part_number: MT40A1G8WE-083E:B; Voltage: NA; Wattage: NA; Package: FBGA78; Distributor_name: DIGIKEY; Distributor_part_number: 557-1727-1-ND; Height: 1.20MM; Weight: NA; Temperature: 0°C+95°C; Datasheet: Y:\MIS_DATABASE\DATASHEETS\ICS\MEMORY\MT40AXX.PDF; Crtd /date: MANIRAJA/220817; Chkd/date: MANIRAJA/220817; MECHANICAL 3D STEP FILE: FBGA78_31-49_320X480_1-2